# EAGLE design nav (EAGLE 9.0.0)

## Sheet 1 of 4: Atmega
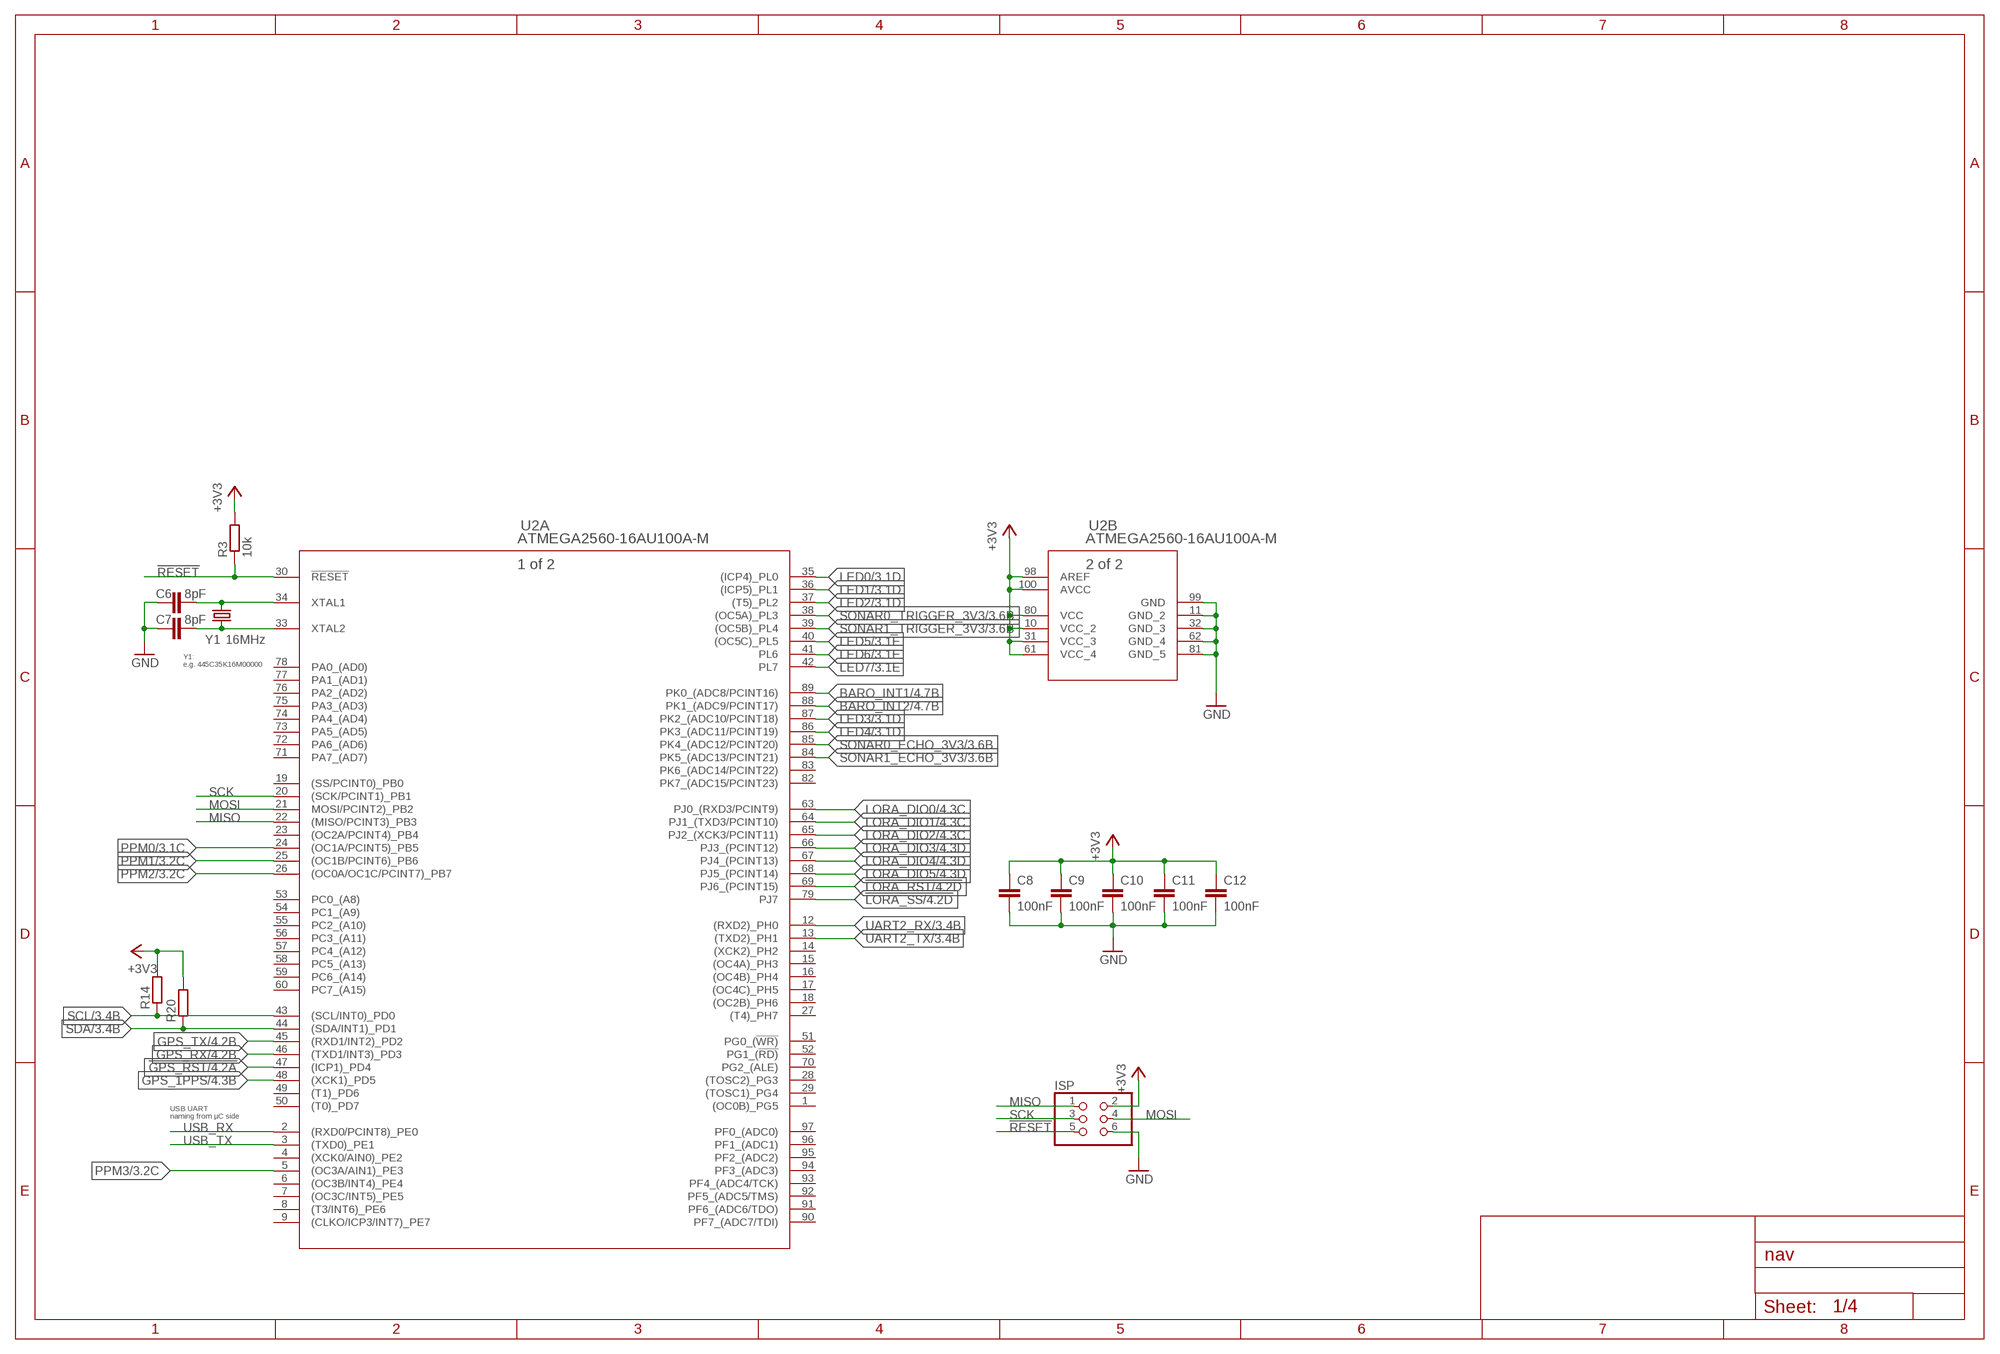
[diagram p0: schematic, sheet 1]

### Parts
C6  8pF  C-EUC0603  [C0603]
C7  8pF  C-EUC0603  [C0603]
C8  100nF  C-EUC0603  [C0603]
C9  100nF  C-EUC0603  [C0603]
C10  100nF  C-EUC0603  [C0603]
C11  100nF  C-EUC0603  [C0603]
C12  100nF  C-EUC0603  [C0603]
ISP  PINHD-2X3  [2X03]
R3  10k  R-EU_R0603  [R0603]
R14  R-EU_R0603  [R0603]
R20  R-EU_R0603  [R0603]
U2  ATMEGA2560-16AU100A-M  [100A-M]
Y1  16MHz  CRYSTALSMD-5X3.2-2PAD  [CRYSTAL-SMD-5X3.2-2PAD]

### Nets
!GPS_RST: U2.47(A:(ICP1)_PD4) ; also sheet 4
!LORA_RST: U2.69(A:PJ6_(PCINT15)) ; also sheet 4
!LORA_SS: U2.79(A:PJ7) ; also sheet 4
!RESET: ISP.5 R3.1 U2.30(A:!RESET) ; also sheet 3
+3V3: C8.1 C9.1 C10.1 C11.1 C12.1 ISP.2 R3.2 R14.2 R20.2 U2.10(B:VCC_2) U2.31(B:VCC_3) U2.61(B:VCC_4) U2.80(B:VCC) U2.98(B:AREF) U2.100(B:AVCC) ; also sheet 2,3,4
BARO_INT1: U2.89(A:PK0_(ADC8/PCINT16)) ; also sheet 4
BARO_INT2: U2.88(A:PK1_(ADC9/PCINT17)) ; also sheet 4
GND: C6.1 C7.1 C8.2 C9.2 C10.2 C11.2 C12.2 ISP.6 U2.11(B:GND_2) U2.32(B:GND_3) U2.62(B:GND_4) U2.81(B:GND_5) U2.99(B:GND) ; also sheet 2,3,4
GPS_1PPS: U2.48(A:(XCK1)_PD5) ; also sheet 4
GPS_RX: U2.46(A:(TXD1/INT3)_PD3) ; also sheet 4
GPS_TX: U2.45(A:(RXD1/INT2)_PD2) ; also sheet 4
LED0: U2.35(A:(ICP4)_PL0) ; also sheet 3
LED1: U2.36(A:(ICP5)_PL1) ; also sheet 3
LED2: U2.37(A:(T5)_PL2) ; also sheet 3
LED3: U2.87(A:PK2_(ADC10/PCINT18)) ; also sheet 3
LED4: U2.86(A:PK3_(ADC11/PCINT19)) ; also sheet 3
LED5: U2.40(A:(OC5C)_PL5) ; also sheet 3
LED6: U2.41(A:PL6) ; also sheet 3
LED7: U2.42(A:PL7) ; also sheet 3
LORA_DIO0: U2.63(A:PJ0_(RXD3/PCINT9)) ; also sheet 4
LORA_DIO1: U2.64(A:PJ1_(TXD3/PCINT10)) ; also sheet 4
LORA_DIO2: U2.65(A:PJ2_(XCK3/PCINT11)) ; also sheet 4
LORA_DIO3: U2.66(A:PJ3_(PCINT12)) ; also sheet 4
LORA_DIO4: U2.67(A:PJ4_(PCINT13)) ; also sheet 4
LORA_DIO5: U2.68(A:PJ5_(PCINT14)) ; also sheet 4
MISO: ISP.1 U2.22(A:(MISO/PCINT3)_PB3) ; also sheet 4
MOSI: ISP.4 U2.21(A:MOSI/PCINT2)_PB2) ; also sheet 4
N$2: C6.2 U2.34(A:XTAL1) Y1.P$2
N$3: C7.2 U2.33(A:XTAL2) Y1.P$1
PPM0: U2.24(A:(OC1A/PCINT5)_PB5) ; also sheet 3
PPM1: U2.25(A:(OC1B/PCINT6)_PB6) ; also sheet 3
PPM2: U2.26(A:(OC0A/OC1C/PCINT7)_PB7) ; also sheet 3
PPM3: U2.5(A:(OC3A/AIN1)_PE3) ; also sheet 3
SCK: ISP.3 U2.20(A:(SCK/PCINT1)_PB1) ; also sheet 4
SCL: R14.1 U2.43(A:(SCL/INT0)_PD0) ; also sheet 3,4
SDA: R20.1 U2.44(A:(SDA/INT1)_PD1) ; also sheet 3,4
SONAR0_ECHO_3V3: U2.85(A:PK4_(ADC12/PCINT20)) ; also sheet 3
SONAR0_TRIGGER_3V3: U2.38(A:(OC5A)_PL3) ; also sheet 3
SONAR1_ECHO_3V3: U2.84(A:PK5_(ADC13/PCINT21)) ; also sheet 3
SONAR1_TRIGGER_3V3: U2.39(A:(OC5B)_PL4) ; also sheet 3
UART2_RX: U2.12(A:(RXD2)_PH0) ; also sheet 3
UART2_TX: U2.13(A:(TXD2)_PH1) ; also sheet 3
USB_RX: U2.2(A:(RXD0/PCINT8)_PE0) ; also sheet 2
USB_TX: U2.3(A:(TXD0)_PE1) ; also sheet 2
Unconnected: U2.1(A:(OC0B)_PG5) U2.4(A:(XCK0/AIN0)_PE2) U2.6(A:(OC3B/INT4)_PE4) U2.7(A:(OC3C/INT5)_PE5) U2.8(A:(T3/INT6)_PE6) U2.9(A:(CLKO/ICP3/INT7)_PE7) U2.14(A:(XCK2)_PH2) U2.15(A:(OC4A)_PH3) U2.16(A:(OC4B)_PH4) U2.17(A:(OC4C)_PH5) U2.18(A:(OC2B)_PH6) U2.19(A:(SS/PCINT0)_PB0) U2.23(A:(OC2A/PCINT4)_PB4) U2.27(A:(T4)_PH7) U2.28(A:(TOSC2)_PG3) U2.29(A:(TOSC1)_PG4) U2.49(A:(T1)_PD6) U2.50(A:(T0)_PD7) U2.51(A:PG0_(!WR)) U2.52(A:PG1_(!RD)) U2.53(A:PC0_(A8)) U2.54(A:PC1_(A9)) U2.55(A:PC2_(A10)) U2.56(A:PC3_(A11)) U2.57(A:PC4_(A12)) U2.58(A:PC5_(A13)) U2.59(A:PC6_(A14)) U2.60(A:PC7_(A15)) U2.70(A:PG2_(ALE)) U2.71(A:PA7_(AD7)) U2.72(A:PA6_(AD6)) U2.73(A:PA5_(AD5)) U2.74(A:PA4_(AD4)) U2.75(A:PA3_(AD3)) U2.76(A:PA2_(AD2)) U2.77(A:PA1_(AD1)) U2.78(A:PA0_(AD0)) U2.82(A:PK7_(ADC15/PCINT23)) U2.83(A:PK6_(ADC14/PCINT22)) U2.90(A:PF7_(ADC7/TDI)) U2.91(A:PF6_(ADC6/TDO)) U2.92(A:PF5_(ADC5/TMS)) U2.93(A:PF4_(ADC4/TCK)) U2.94(A:PF3_(ADC3)) U2.95(A:PF2_(ADC2)) U2.96(A:PF1_(ADC1)) U2.97(A:PF0_(ADC0))

### Notes on the sheet
- Y1:
  e.g. 445C35K16M00000
- USB UART
  naming from µC side

## Sheet 2 of 4: USB-UART
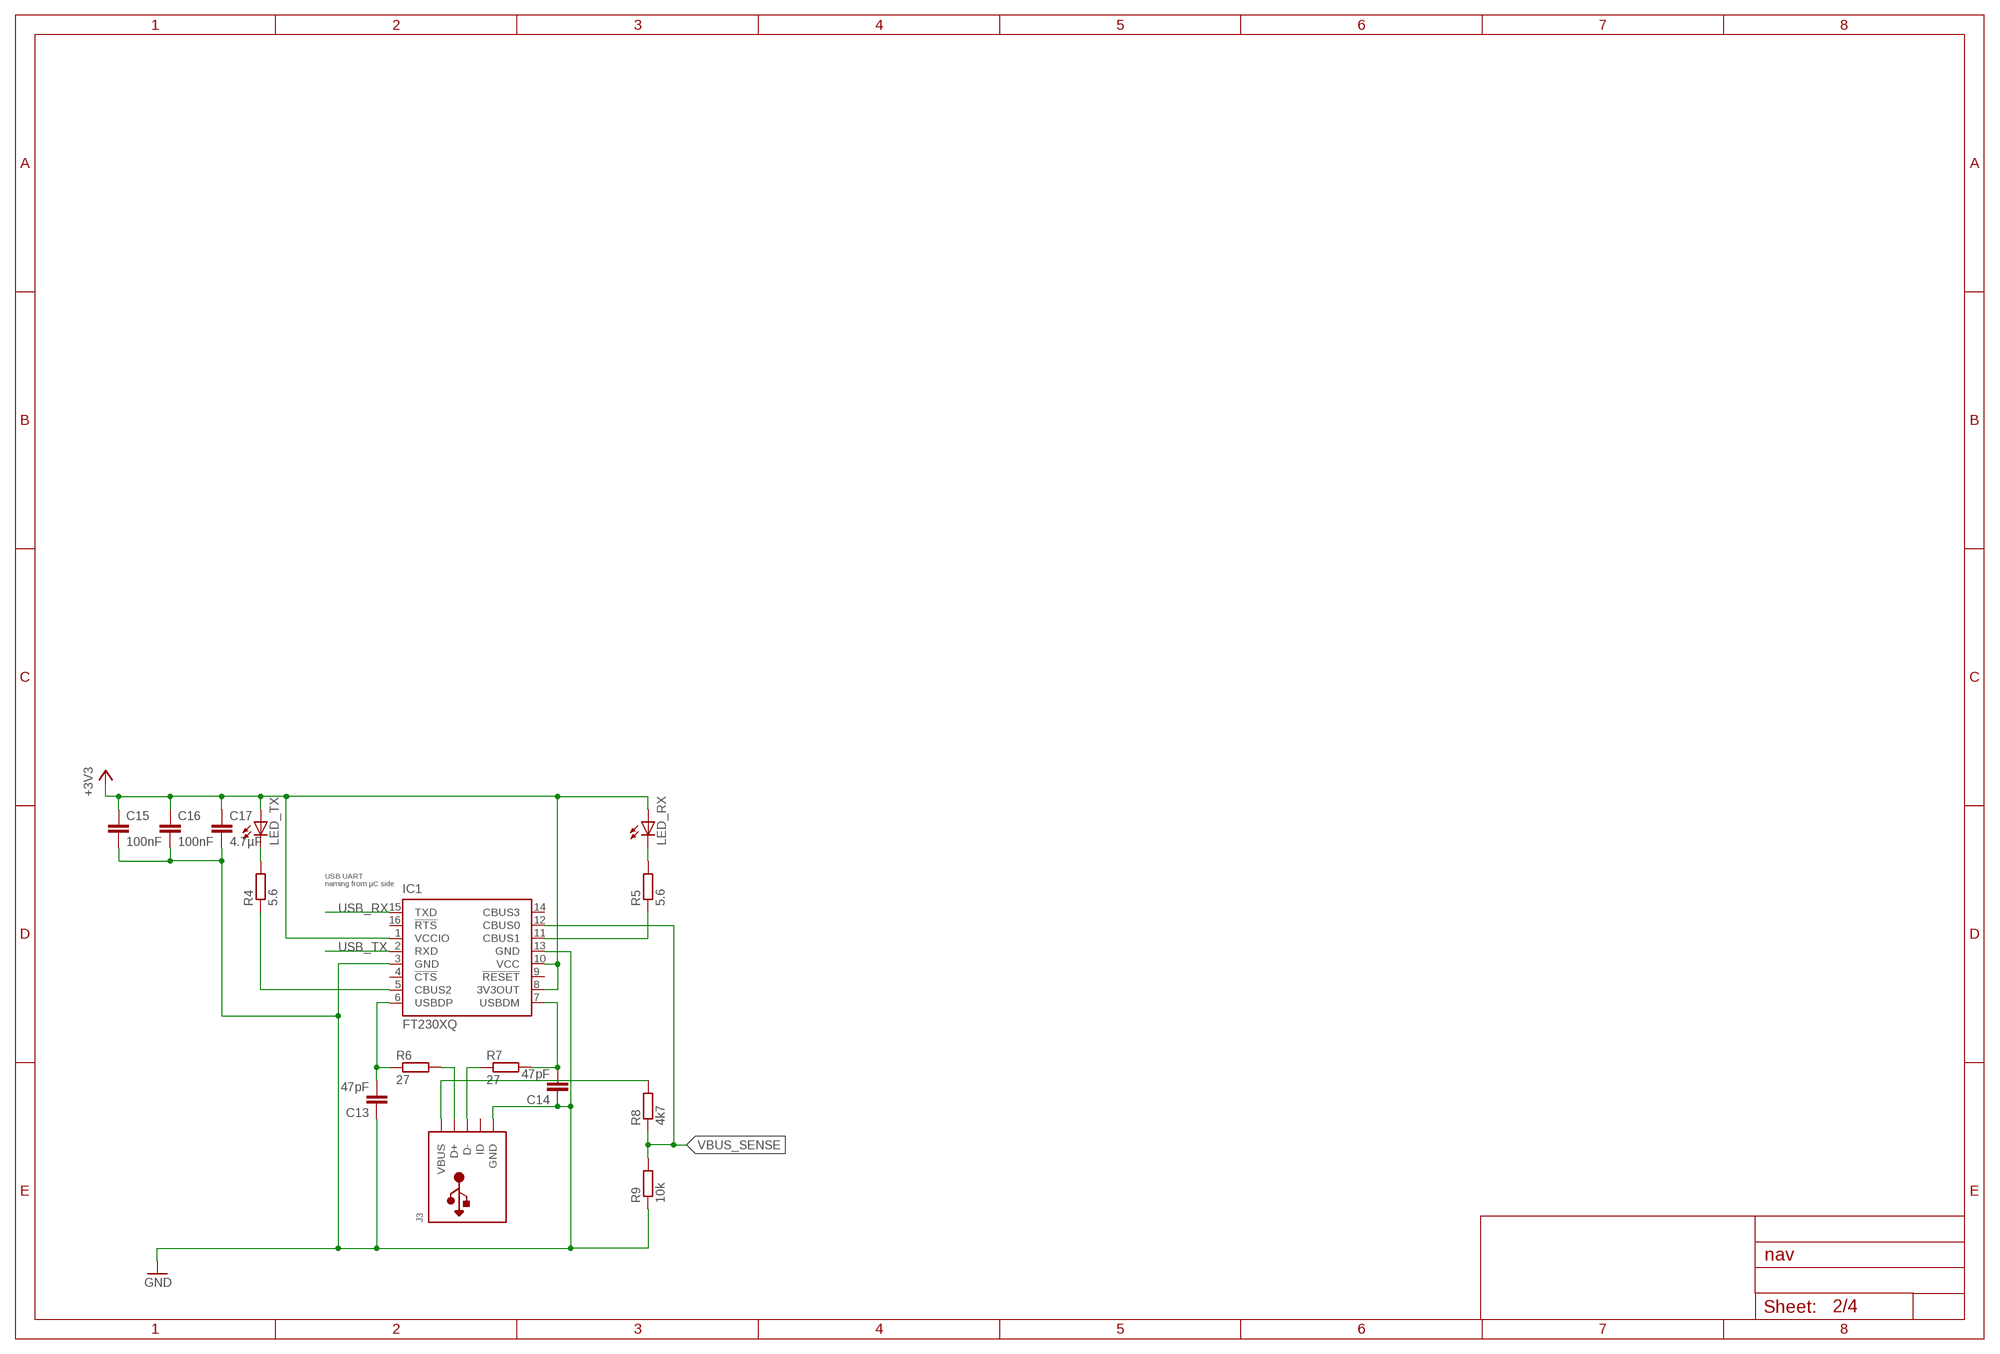
[diagram p1: schematic, sheet 2]

### Parts
C13  47pF  C-EUC0603  [C0603]
C14  47pF  C-EUC0603  [C0603]
C15  100nF  C-EUC0603  [C0603]
C16  100nF  C-EUC0603  [C0603]
C17  4.7µF  C-EUC0603  [C0603]
IC1  FT230XQ  [QFN16]
J3  USBMINIB  [USB-MINIB]
LED_RX  LEDCHIP-LED0603  [CHIP-LED0603]
LED_TX  LEDCHIP-LED0603  [CHIP-LED0603]
R4  5.6  R-EU_R0603  [R0603]
R5  5.6  R-EU_R0603  [R0603]
R6  27  R-EU_R0603  [R0603]
R7  27  R-EU_R0603  [R0603]
R8  4k7  R-EU_R0603  [R0603]
R9  10k  R-EU_R0603  [R0603]

### Nets
+3V3: C15.1 C16.1 C17.1 IC1.1(VCCIO) IC1.8(3V3OUT) IC1.10(VCC) LED_RX.A LED_TX.A ; also sheet 1,3,4
GND: C13.1 C14.1 C15.2 C16.2 C17.2 IC1.3(GND) IC1.13(GND) J3.GND R9.1 ; also sheet 1,3,4
N$4: C13.2 IC1.6(USBDP) R6.1
N$5: C14.2 IC1.7(USBDM) R7.2
N$6: IC1.5(CBUS2) R4.1
N$7: IC1.11(CBUS1) R5.1
N$8: LED_TX.C R4.2
N$9: LED_RX.C R5.2
N$10: J3.D+ R6.2
N$11: J3.D- R7.1
N$16: J3.VBUS R8.2
USB_RX: IC1.15(TXD) ; also sheet 1
USB_TX: IC1.2(RXD) ; also sheet 1
VBUS_SENSE: IC1.12(CBUS0) R8.1 R9.2
Unconnected: IC1.4(!CTS) IC1.9(!RESET) IC1.14(CBUS3) IC1.16(!RTS) J3.ID

### Notes on the sheet
- USB UART
  naming from µC side

## Sheet 3 of 4: IO
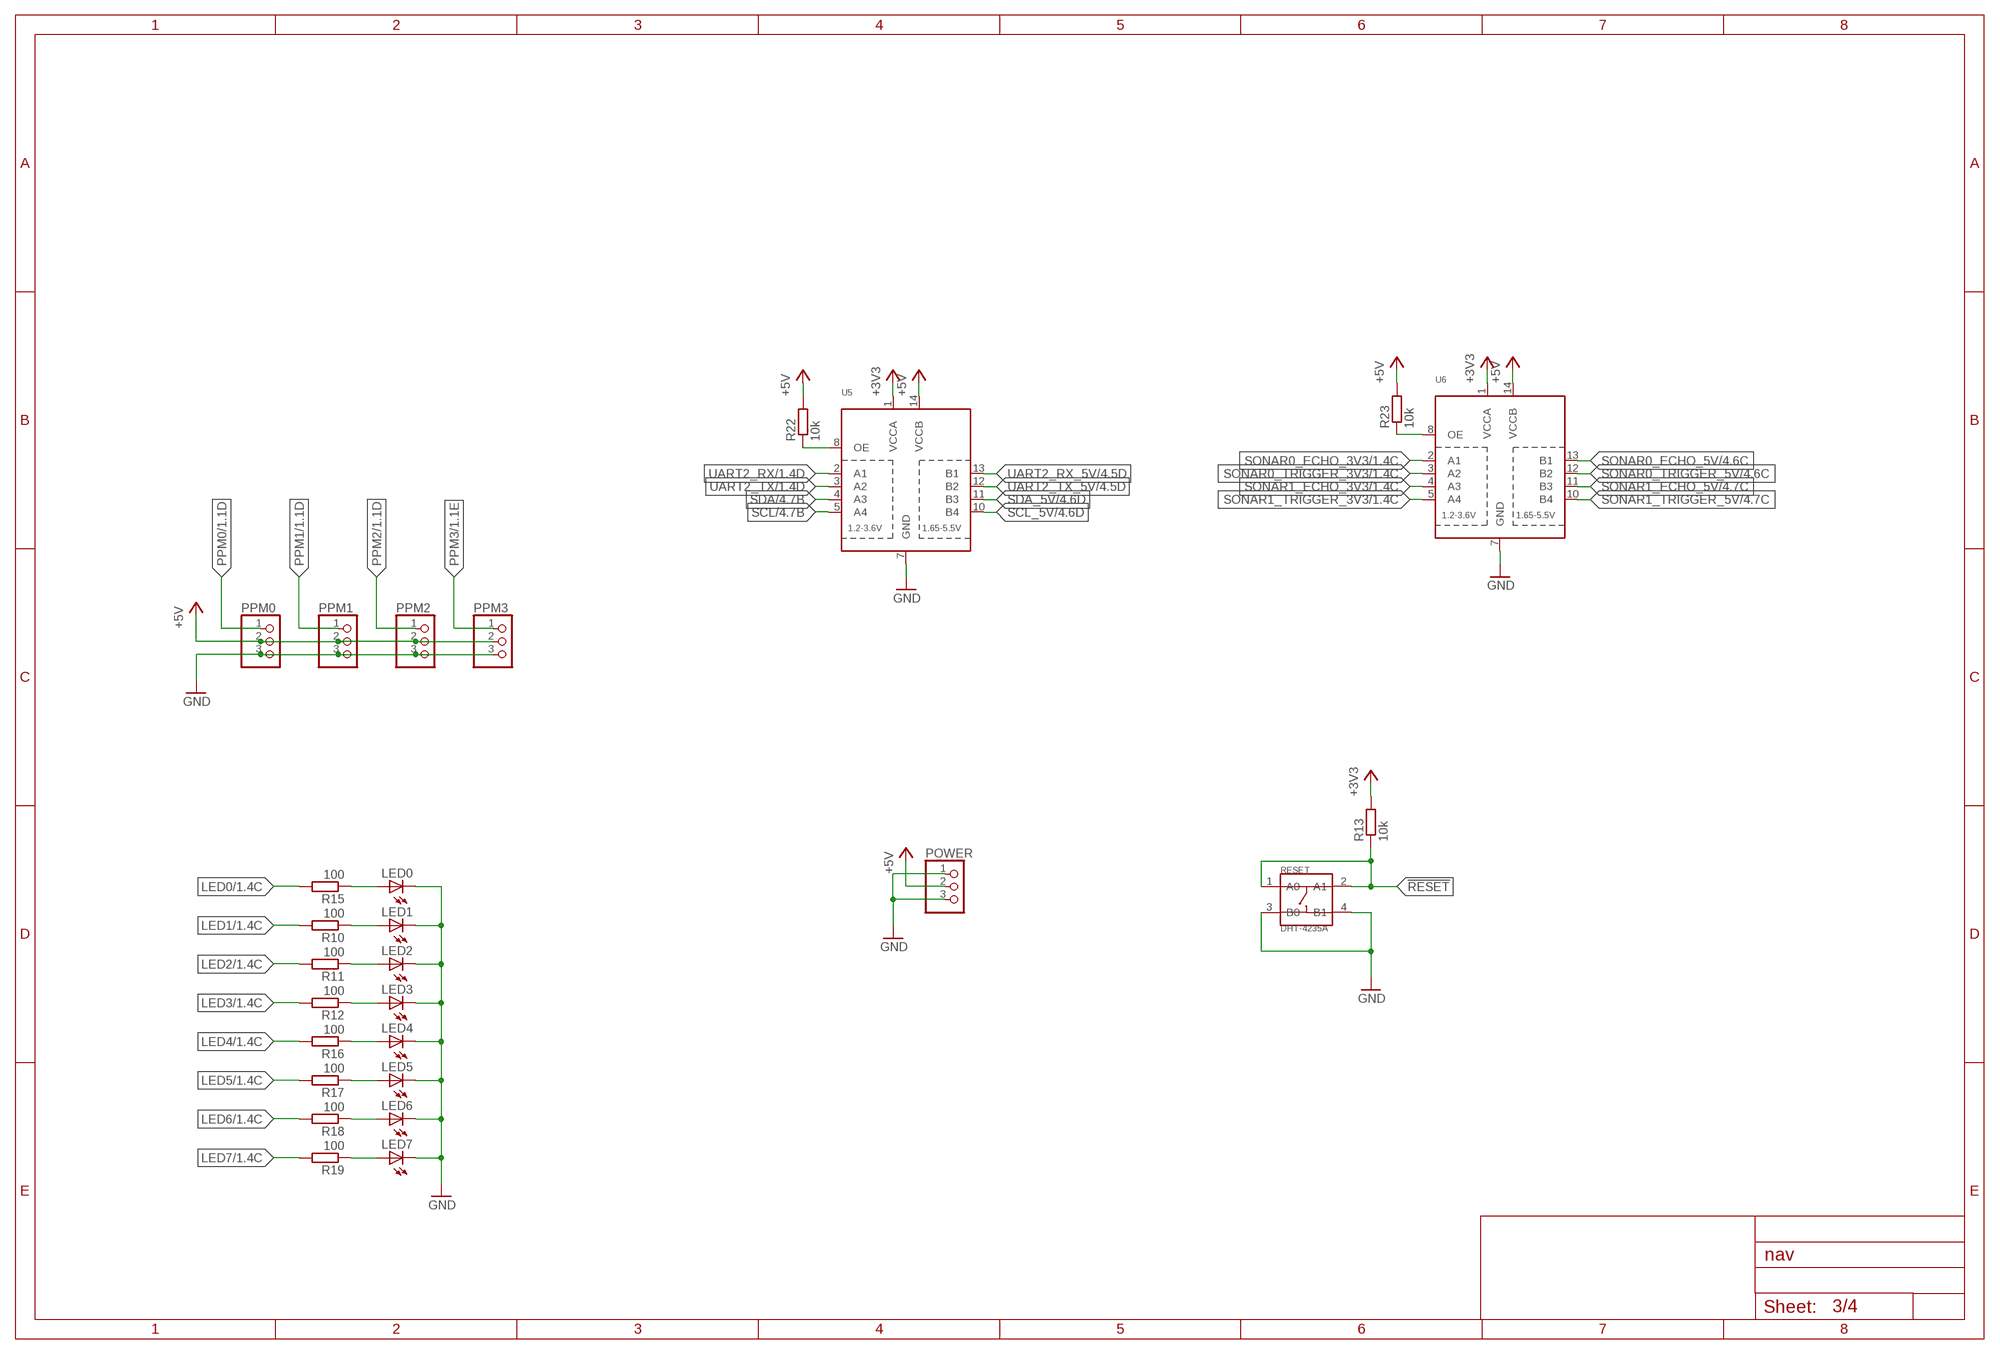
[diagram p2: schematic, sheet 3]

### Parts
LED0  LEDCHIP-LED0603  [CHIP-LED0603]
LED1  LEDCHIP-LED0603  [CHIP-LED0603]
LED2  LEDCHIP-LED0603  [CHIP-LED0603]
LED3  LEDCHIP-LED0603  [CHIP-LED0603]
LED4  LEDCHIP-LED0603  [CHIP-LED0603]
LED5  LEDCHIP-LED0603  [CHIP-LED0603]
LED6  LEDCHIP-LED0603  [CHIP-LED0603]
LED7  LEDCHIP-LED0603  [CHIP-LED0603]
POWER  PINHD-1X3  [1X03]
PPM0  PINHD-1X3  [1X03]
PPM1  PINHD-1X3  [1X03]
PPM2  PINHD-1X3  [1X03]
PPM3  PINHD-1X3  [1X03]
R10  100  R-EU_R0603  [R0603]
R11  100  R-EU_R0603  [R0603]
R12  100  R-EU_R0603  [R0603]
R13  10k  R-EU_R0603  [R0603]
R15  100  R-EU_R0603  [R0603]
R16  100  R-EU_R0603  [R0603]
R17  100  R-EU_R0603  [R0603]
R18  100  R-EU_R0603  [R0603]
R19  100  R-EU_R0603  [R0603]
R22  10k  R-EU_R0603  [R0603]
R23  10k  R-EU_R0603  [R0603]
RESET  DHT-4235A  SMD-BUTTON-TOP-DHT-4235A(4P-4.2X3.2MM)  [SW4-SMD-4.2X3.2X2.5MM]
U5  TXB0104PWR  [TSSOP14]
U6  TXB0104PWR  [TSSOP14]

### Nets
!RESET: R13.1 RESET.1(A0) RESET.2(A1) ; also sheet 1
+3V3: R13.2 U5.1(VCCA) U6.1(VCCA) ; also sheet 1,2,4
+5V: POWER.2 PPM0.2 PPM1.2 PPM2.2 PPM3.2 R22.2 R23.2 U5.14(VCCB) U6.14(VCCB) ; also sheet 4
GND: LED0.C LED1.C LED2.C LED3.C LED4.C LED5.C LED6.C LED7.C POWER.1 POWER.3 PPM0.3 PPM1.3 PPM2.3 PPM3.3 RESET.3(B0) RESET.4(B1) U5.7(GND) U6.7(GND) ; also sheet 1,2,4
LED0: R15.2 ; also sheet 1
LED1: R10.2 ; also sheet 1
LED2: R11.2 ; also sheet 1
LED3: R12.2 ; also sheet 1
LED4: R16.2 ; also sheet 1
LED5: R17.2 ; also sheet 1
LED6: R18.2 ; also sheet 1
LED7: R19.2 ; also sheet 1
N$15: LED1.A R10.1
N$18: LED2.A R11.1
N$20: LED3.A R12.1
N$22: LED4.A R16.1
N$24: LED5.A R17.1
N$27: LED6.A R18.1
N$29: LED7.A R19.1
N$31: LED0.A R15.1
N$36: R23.1 U6.8(OE)
N$37: R22.1 U5.8(OE)
PPM0: PPM0.1 ; also sheet 1
PPM1: PPM1.1 ; also sheet 1
PPM2: PPM2.1 ; also sheet 1
PPM3: PPM3.1 ; also sheet 1
SCL: U5.5(A4) ; also sheet 1,4
SCL_5V: U5.10(B4) ; also sheet 4
SDA: U5.4(A3) ; also sheet 1,4
SDA_5V: U5.11(B3) ; also sheet 4
SONAR0_ECHO_3V3: U6.2(A1) ; also sheet 1
SONAR0_ECHO_5V: U6.13(B1) ; also sheet 4
SONAR0_TRIGGER_3V3: U6.3(A2) ; also sheet 1
SONAR0_TRIGGER_5V: U6.12(B2) ; also sheet 4
SONAR1_ECHO_3V3: U6.4(A3) ; also sheet 1
SONAR1_ECHO_5V: U6.11(B3) ; also sheet 4
SONAR1_TRIGGER_3V3: U6.5(A4) ; also sheet 1
SONAR1_TRIGGER_5V: U6.10(B4) ; also sheet 4
UART2_RX: U5.2(A1) ; also sheet 1
UART2_RX_5V: U5.13(B1) ; also sheet 4
UART2_TX: U5.3(A2) ; also sheet 1
UART2_TX_5V: U5.12(B2) ; also sheet 4

## Sheet 4 of 4: Sensors
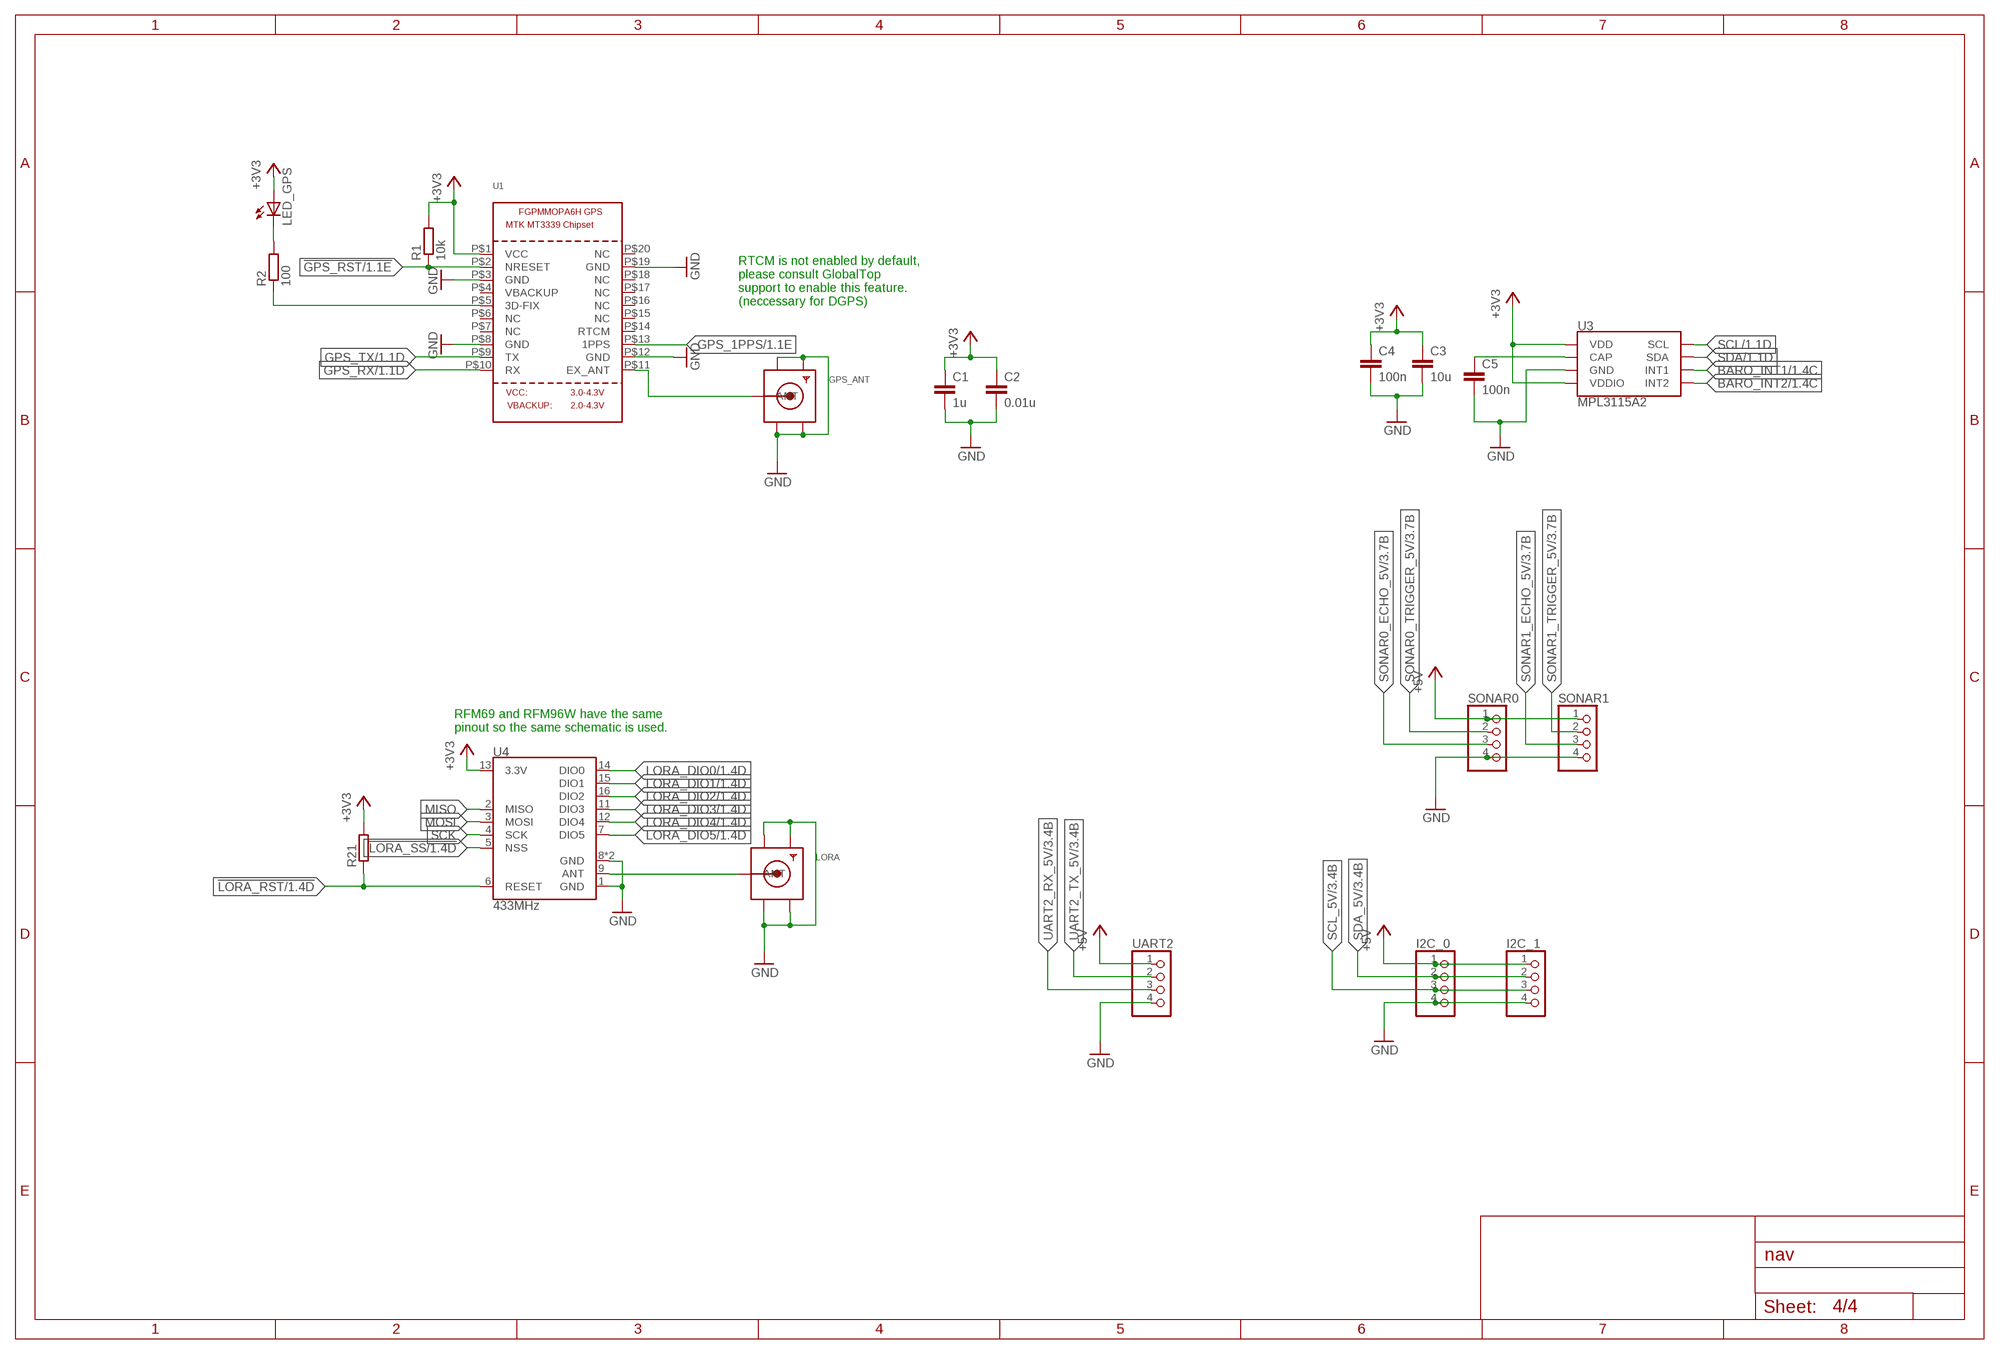
[diagram p3: schematic, sheet 4]

### Parts
C1  1u  C-EUC0603  [C0603]
C2  0.01u  C-EUC0603  [C0603]
C3  10u  C-EUC0603  [C0603]
C4  100n  C-EUC0603  [C0603]
C5  100n  C-EUC0603  [C0603]
GPS_ANT  SMACONNECTOR_EDGE  [SMA_EDGELAUNCH]
I2C_0  PINHD-1X4  [1X04]
I2C_1  PINHD-1X4  [1X04]
LED_GPS  LEDCHIP-LED0603  [CHIP-LED0603]
LORA  SMACONNECTOR_EDGE  [SMA_EDGELAUNCH]
R1  10k  R-EU_R0603  [R0603]
R2  100  R-EU_R0603  [R0603]
R21  R-EU_R0603  [R0603]
SONAR0  PINHD-1X4  [1X04]
SONAR1  PINHD-1X4  [1X04]
U1  GPS_FGPMMOPA6H  [FGPMMOPA6H]
U3  MPL3115A2  [LGA-8-5X3]
U4  433MHz  RFM69HCW-433  [RFM69HCW-XXXS2]
UART2  PINHD-1X4  [1X04]

### Nets
!GPS_RST: R1.1 U1.P$2(NRESET) ; also sheet 1
!LORA_RST: R21.1 U4.6(RESET) ; also sheet 1
!LORA_SS: U4.5(NSS) ; also sheet 1
+3V3: C1.1 C2.1 C3.1 C4.1 LED_GPS.A R1.2 R21.2 U1.P$1(VCC) U3.1(VDD) U3.4(VDDIO) U4.13(3.3V) ; also sheet 1,2,3
+5V: I2C_0.1 I2C_1.1 SONAR0.1 SONAR1.1 UART2.1 ; also sheet 3
BARO_INT1: U3.6(INT1) ; also sheet 1
BARO_INT2: U3.5(INT2) ; also sheet 1
GND: C1.2 C2.2 C3.2 C4.2 C5.2 GPS_ANT.GND@1(GND4) GPS_ANT.GND@2(GND3) GPS_ANT.GND@3(GND2) GPS_ANT.GND@4(GND1) I2C_0.4 I2C_1.4 LORA.GND@1(GND4) LORA.GND@2(GND3) LORA.GND@3(GND2) LORA.GND@4(GND1) SONAR0.4 SONAR1.4 U1.P$3(GND) U1.P$8(GND) U1.P$12(GND) U1.P$19(GND) U3.3(GND) U4.1(GND) U4.8(GND) U4.10(GND) UART2.4 ; also sheet 1,2,3
GPS_1PPS: U1.P$13(1PPS) ; also sheet 1
GPS_RX: U1.P$10(RX) ; also sheet 1
GPS_TX: U1.P$9(TX) ; also sheet 1
LORA_DIO0: U4.14(DIO0) ; also sheet 1
LORA_DIO1: U4.15(DIO1) ; also sheet 1
LORA_DIO2: U4.16(DIO2) ; also sheet 1
LORA_DIO3: U4.11(DIO3) ; also sheet 1
LORA_DIO4: U4.12(DIO4) ; also sheet 1
LORA_DIO5: U4.7(DIO5) ; also sheet 1
MISO: U4.2(MISO) ; also sheet 1
MOSI: U4.3(MOSI) ; also sheet 1
N$1: GPS_ANT.P(ANT) U1.P$11(EX_ANT)
N$12: R2.1 U1.P$5(3D-FIX)
N$13: LED_GPS.C R2.2
N$17: C5.1 U3.2(CAP)
N$30: LORA.P(ANT) U4.9(ANT)
SCK: U4.4(SCK) ; also sheet 1
SCL: U3.8(SCL) ; also sheet 1,3
SCL_5V: I2C_0.3 I2C_1.3 ; also sheet 3
SDA: U3.7(SDA) ; also sheet 1,3
SDA_5V: I2C_0.2 I2C_1.2 ; also sheet 3
SONAR0_ECHO_5V: SONAR0.3 ; also sheet 3
SONAR0_TRIGGER_5V: SONAR0.2 ; also sheet 3
SONAR1_ECHO_5V: SONAR1.3 ; also sheet 3
SONAR1_TRIGGER_5V: SONAR1.2 ; also sheet 3
UART2_RX_5V: UART2.3 ; also sheet 3
UART2_TX_5V: UART2.2 ; also sheet 3
Unconnected: U1.P$4(VBACKUP) U1.P$6(NC) U1.P$7(NC) U1.P$14(RTCM) U1.P$15(NC) U1.P$16(NC) U1.P$17(NC) U1.P$18(NC) U1.P$20(NC)

### Notes on the sheet
- RTCM is not enabled by default,
  please consult GlobalTop
  support to enable this feature.
  (neccessary for DGPS)
- RFM69 and RFM96W have the same
  pinout so the same schematic is used.

## Library data of the parts
C1-C5 = resistor:C-EU: CAPACITOR, European symbol
C6-C17 = rcl:C-EU: CAPACITOR, European symbol; SPICEPREFIX: C
GPS_ANT LORA = adafruit:SMACONNECTOR: SMA Connector 90° DIP SMA Connector, 50 Ohm (4UConnector: 07259)
I2C_0 I2C_1 SONAR0 SONAR1 UART2 = pinhead:PINHD-1X4: PIN HEADER
IC1 = ftdichip:FT230X: USB to BASIC UART IC Auto generated by make-symbol-device-package-bsdl.ulp Rev. 43 Source: Data sheet <http://www.ftdichip.com/Support/Documents/DataSheets/ICs/DS_FT230X.pdf>
ISP = pinhead:PINHD-2X3: PIN HEADER
J3 = adafruit:USB: USB Connectors USBMINIB - Surface Mount Female Mini-B USB Connector 4UConnector: 06564 By microbuilder.eu Thru-hole RA Female Mini-B USB Connector 4UConnector: 18732 By ladyada.net
LED0 LED1-LED7 LED_GPS LED_RX LED_TX = led:LED: LED OSRAM: - CHIPLED LG R971, LG N971, LY N971, LG Q971, LY Q971, LO R971, LY R971 LH N974, LH R974 LS Q976, LO Q976, LY Q976 LO Q996 - Hyper CHIPLED LW Q18S LB Q993, LB Q99A, LB R99A - SideLED LS A670, LO A670, LY A670, LG A670, LP A670 LB A673, LV A673, LT A673, LW A673 LH A674 LY A675 LS A676, LA A676, LO A676, LY A676, LW A676 LS A679, LY A679, LG A679 - Hyper Micro SIDELED® LS Y876, LA Y876, LO Y876, LY Y876 LT Y87S - SmartLED LW L88C, LW L88S LB L89C, LB L89S, LG L890 LS L89K, LO L89K, LY L89K LS L896, LA L896, LO L896, LY L896 - TOPLED LS T670, LO T670, LY T670, LG T670, LP T670 LSG T670, LSP T670, LSY T670, LOP T670, LYG T670 LG T671, LOG T671, LSG T671 LB T673, LV T673, LT T673, LW T673 LH T674 LS T676, LA T676, LO T676, LY T676, LB T676, LH T676, LSB T676, LW T676 LB T67C, LV T67C, LT T67C, LS T67K, LO T67K, LY T67K, LW E67C LS E67B, LA E67B, LO E67B, LY E67B, LB E67C, LV E67C, LT E67C LW T67C LS T679, LY T679, LG T679 LS T770, LO T770, LY T770, LG T770, LP T770 LB T773, LV T773, LT T773, LW T773 LH T774 LS E675, LA E675, LY E675, LS T675 LS T776, LA T776, LO T776, LY T776, LB T776 LHGB T686 LT T68C, LB T68C - Hyper Mini TOPLED® LB M676 - Mini TOPLED Santana® LG M470 LS M47K, LO M47K, LY M47K Source: http://www.osram.convergy.de LUXEON: - LUMILED® LXK2-PW12-R00, LXK2-PW12-S00, LXK2-PW14-U00, LXK2-PW14-V00 LXK2-PM12-R00, LXK2-PM12-S00, LXK2-PM14-U00 LXK2-PE12-Q00, LXK2-PE12-R00, LXK2-PE12-S00, LXK2-PE14-T00, LXK2-PE14-U00 LXK2-PB12-K00, LXK2-PB12-L00, LXK2-PB12-M00, LXK2-PB14-N00, LXK2-PB14-P00, LXK2-PB14-Q00 LXK2-PR12-L00, LXK2-PR12-M00, LXK2-PR14-Q00, LXK2-PR14-R00 LXK2-PD12-Q00, LXK2-PD12-R00, LXK2-PD12-S00 LXK2-PH12-R00, LXK2-PH12-S00 LXK2-PL12-P00, LXK2-PL12-Q00, LXK2-PL12-R00 Source: www.luxeon.com KINGBRIGHT: KA-3528ASYC Source: www.kingbright.com
POWER PPM0 PPM1-PPM3 = pinhead:PINHD-1X3: PIN HEADER
R1 R2 R13 R14 R20-R23 = resistor:R-EU_: RESISTOR, European symbol
R3-R12 R15-R19 = rcl:R-EU_: RESISTOR, European symbol; SPICEPREFIX: R
RESET = Seeed-Switch:SMD-BUTTON-TOP-DHT-4235A(4P-4.2X3.2MM): 311020045; MPN: DHT-4235A
U1 = adafruit:GPS_FGPMMOPA6H: GPS Module - MTK MT3339 Chipset, -165dBm sensitivity, 22 channels, 10Hz, auto-select external antenna options
U2 = ATMEGA2560:ATMEGA2560-16AU; MANUFACTURER_PART_NUMBER: ATMEGA256016AU; VENDOR: Atmel
U3 = SparkFun-Sensors:MPL3115A2: NXP MPL3115A2 Digital Altimeter/Pressure Sensor The MPL3115A2 is a compact piezoresistive absolute pressure sensor with an I2C interface. MPL3115 has a wide operating range of 20kPa to 110 kPa, a range that covers all surface elevations on Earth. The fully internally compensated MEMS in conjunction with an embedded high resolution 24-bit equivalent ADC provide accurate pressure [Pascals] /altitude [meters] and temperature [degrees Celsius] data. Datasheet <http://cdn.sparkfun.com/datasheets/Sensors/Pressure/MPL3115A2.pdf> SparkFun Products SparkFun Altitude/Pressure Sensor Breakout - MPL3115A2 <https://www.sparkfun.com/products/11084> (SEN-11084) SparkFun Weather Shield <https://www.sparkfun.com/products/12081> (DEV-12081) SparkFun Photon Weather Shield <https://www.sparkfun.com/products/13630> (DEV-13630); PROD_ID: IC-10869
U4 = SparkFun-RF:RFM69H: Hope RF RFM69H ISM Transceiver Module The RFM69H is a transceiver module capable of operation over a wide frequency range, including the 315,433,868 and 915MHz license-free ISM (Industry Scientific and Medical) frequency bands. All major RF communication parameters are programmable and most of them can be dynamically set. The RFM69H offers the unique advantage of programmable narrow-band and wide- band communication modes. The RFM69H is optimized for low power consumption while offering high RF output power and channelized operation.Compliance ETSI and FCC regulations. Datasheet <http://www.hoperf.cn/upload/docs/RF/SX/RFM69H_DataSheet_v1.3.pdf> SparkFun Products RFM69HCW Wireless Transceiver - 915MHz <https://www.sparkfun.com/products/13909> (COM-13909) RFM69HCW Wireless Transceiver - 434MHz <https://www.sparkfun.com/products/13910> (COM-13910) SparkFun RFM69 Breakout (915MHz) <https://www.sparkfun.com/products/12775> (WRL-12775) SparkFun RFM69 Breakout (434MHz) <https://www.sparkfun.com/products/12823> (WRL-12823); PROD_ID: IC-12053
U5 U6 = adafruit:TXB0104PWR: 4-Bit Bi-Directional Level Shifter 1.2V-3.6V (VCCA) to 1.65V-5.5V (VCCB) bi-directional level shifter with auto direction sensing. Max data rate - VCCA 1.8V: 20Mbps (50ns), VCCA 3.3V: 100Mbps (10ns) Digikey: 296-21929-1-ND
Y1 = SparkFun-Clocks:CRYSTAL: Crystals (Generic) These are passive quartz crystals, which can be used as a clock source for a microcontroller. Crystal's are two-terminal devices. They require external "load" capacitors to generate an oscillating signal.

## Board
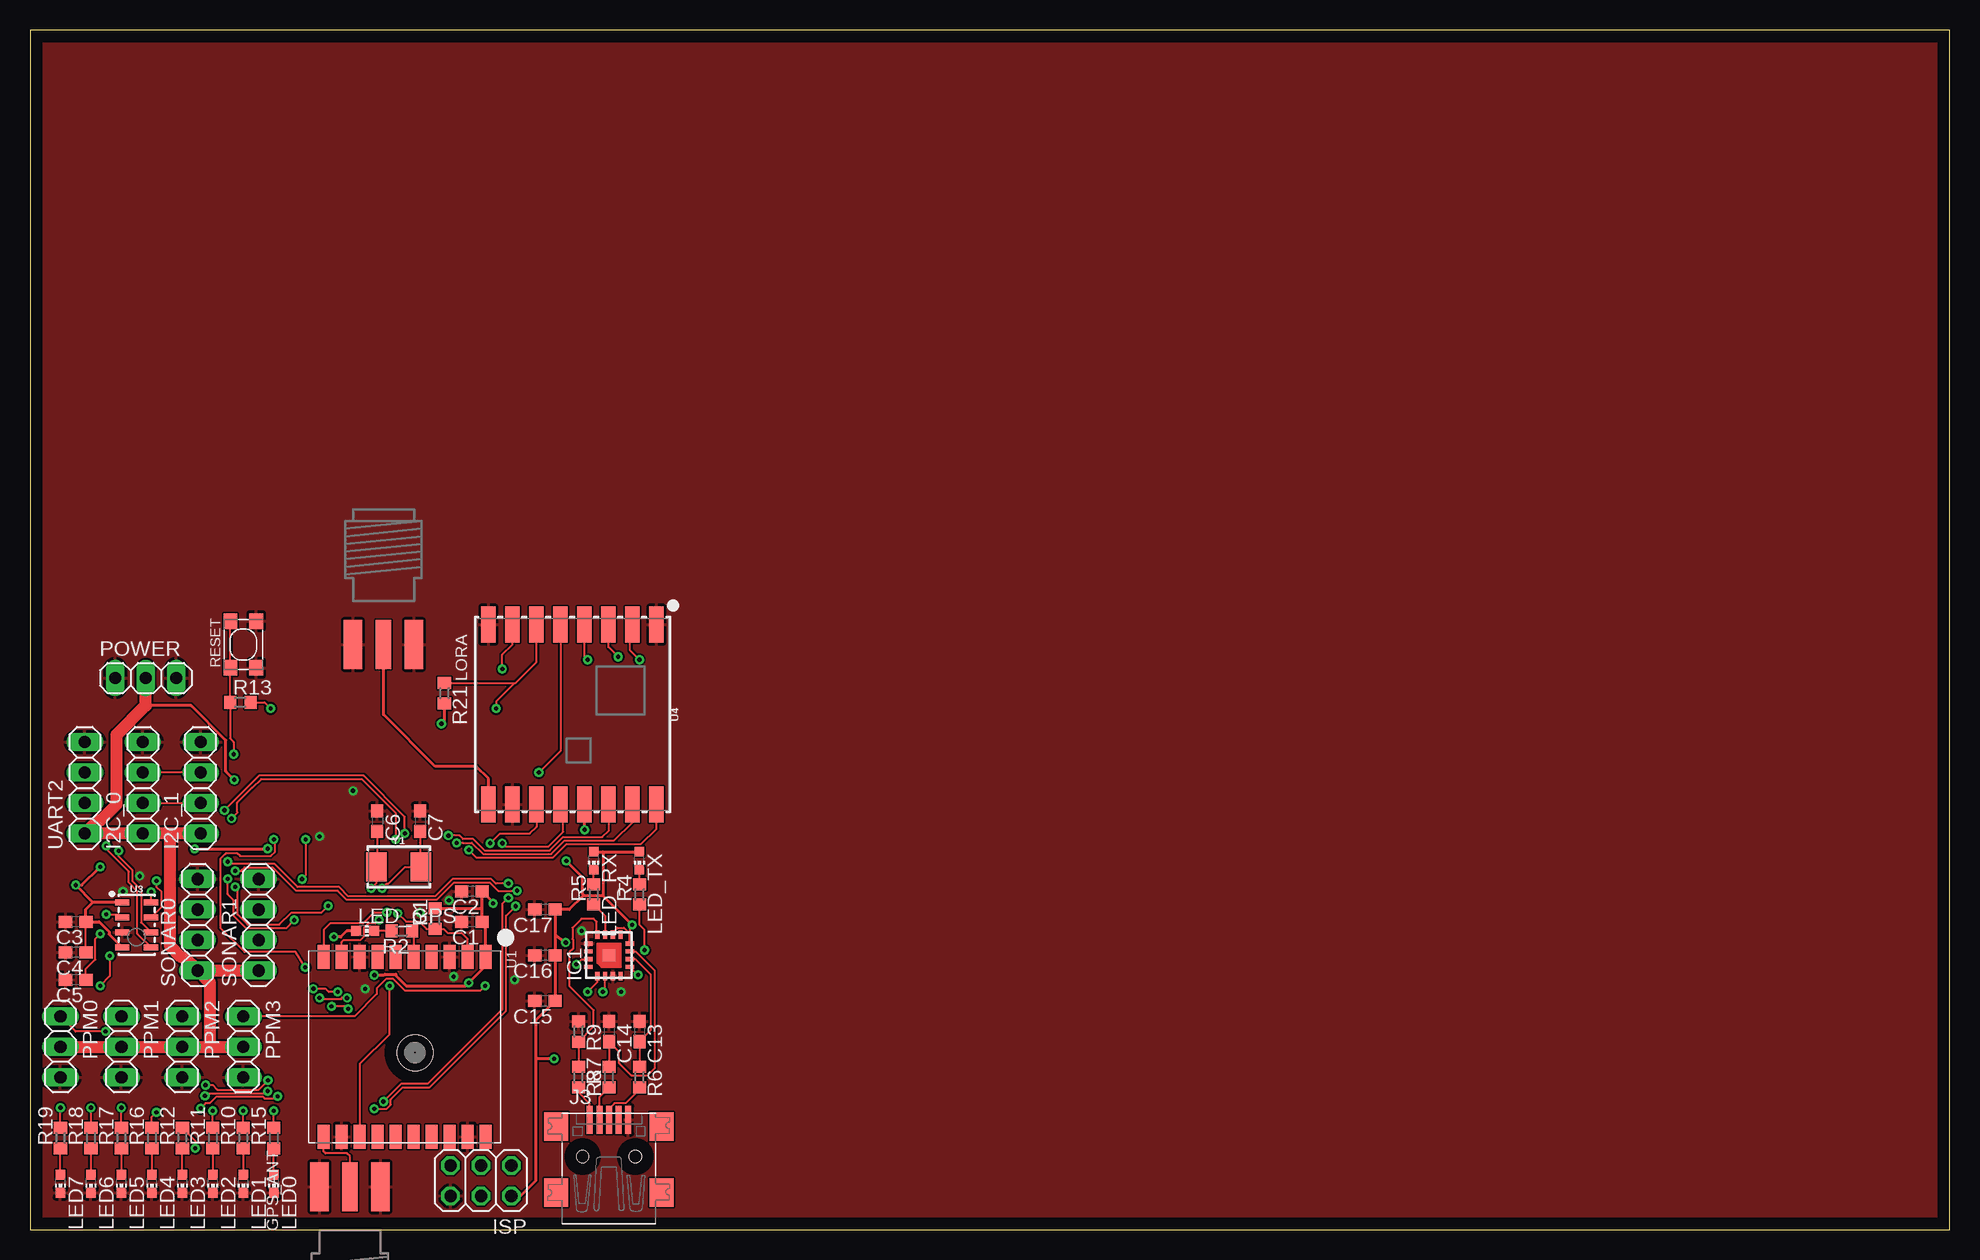
[diagram p4: board, top side]
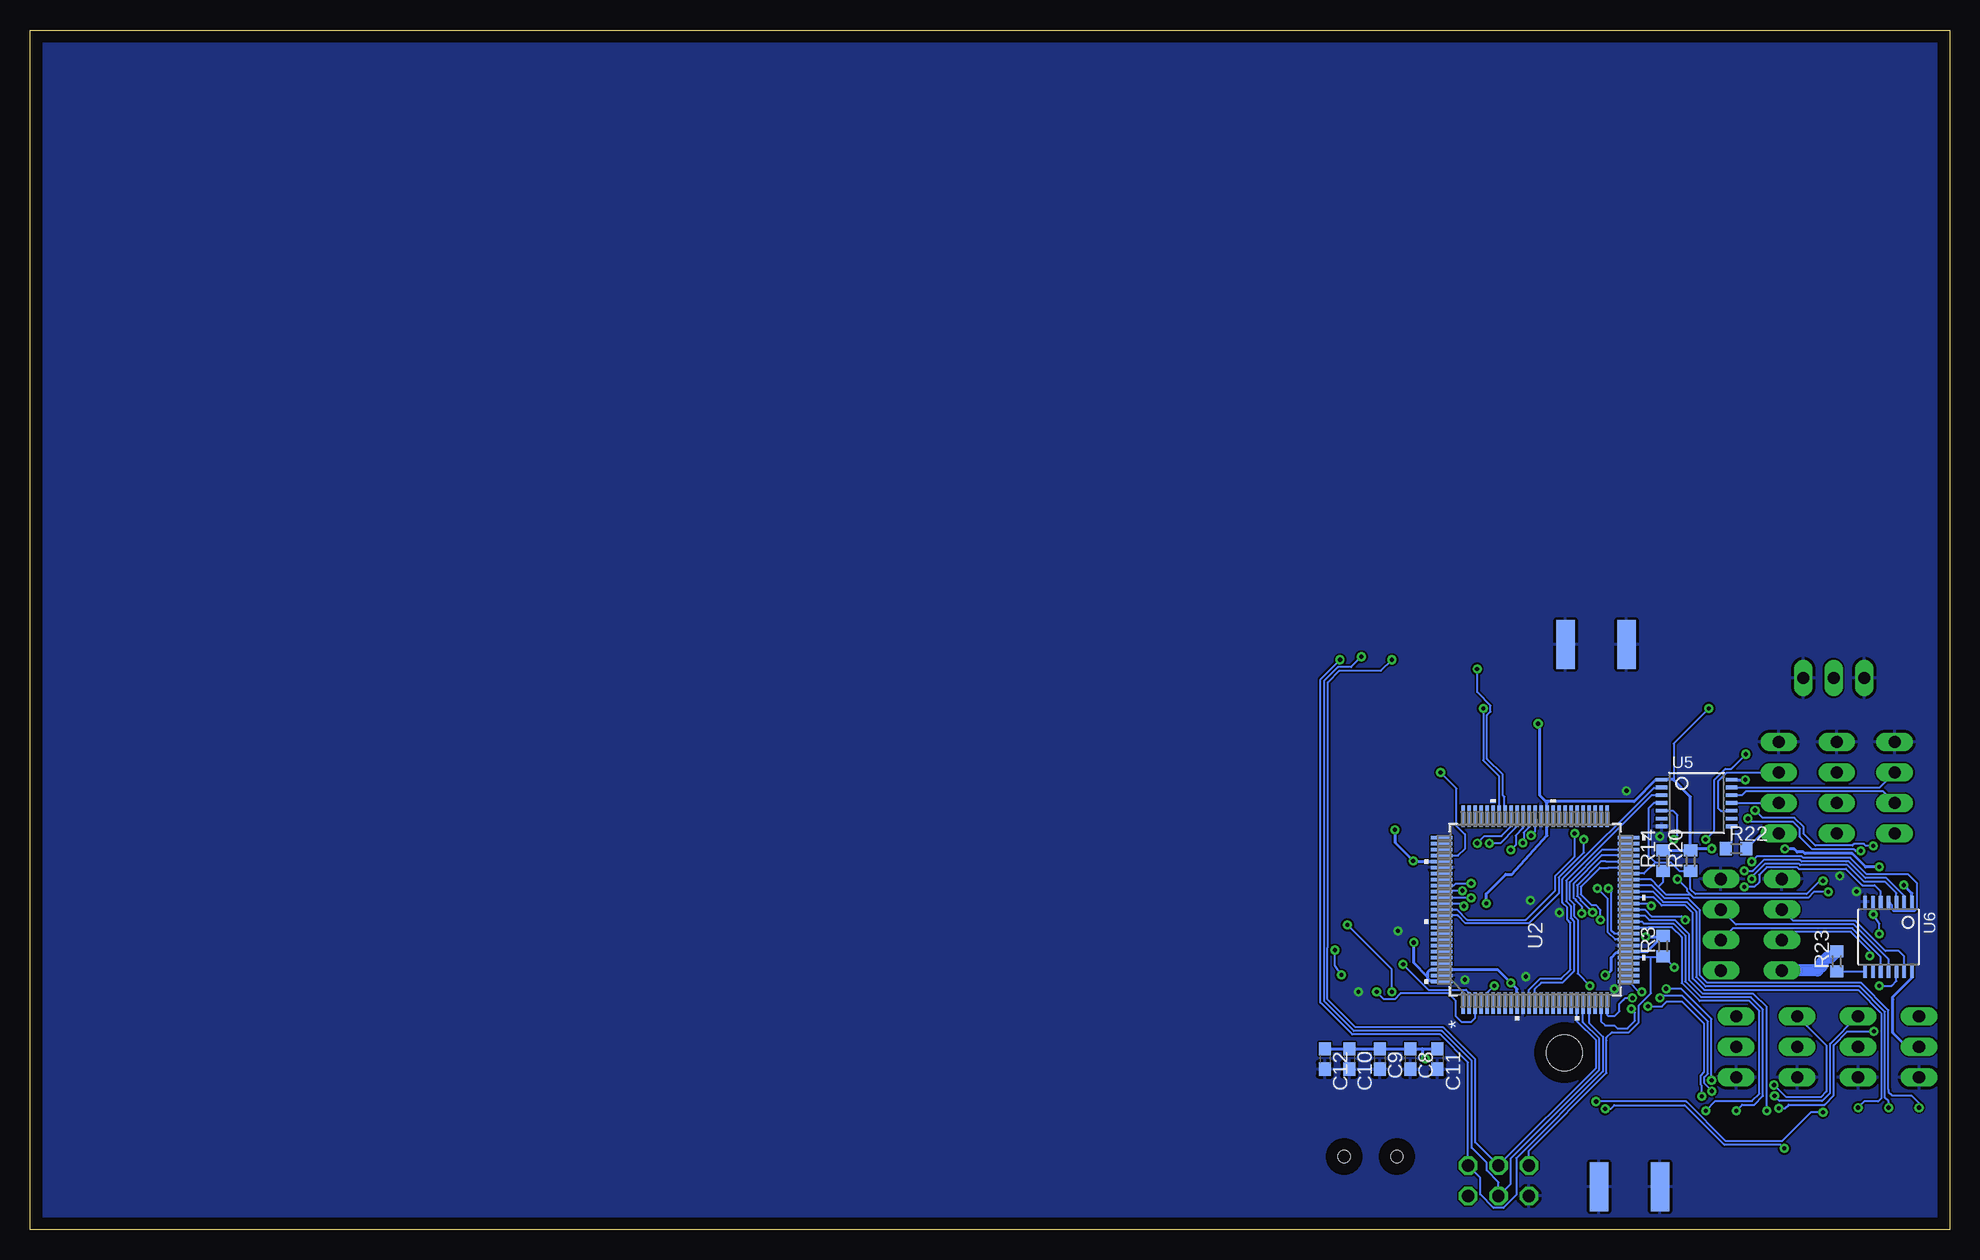
[diagram p5: board, bottom side, seen from below]

Size 160 x 100 mm. Coordinates in mm from the lower left corner, seen from the top.
Outline: 0,0 160,0 160,100 0,100 0,0
Copper layers (1*16): Top 0.035mm / dielectric 1.5mm / Bottom 0.035mm
Design rules "default": minimum track width 6mil, minimum drill 0.35mm, track to track 6mil, track to pad 6mil, pad to pad 6mil, via to via 6mil, smd to smd 6mil, copper to edge 40mil, drill to drill 6mil, minimum pad ring 10mil, minimum via ring 8mil, stop-mask expansion 4mil, vias tented up to drill 0mil, thermal gap 10mil

### Footprints (pad centres in the part's own frame; a part is rotated, then mirrored left to right if it is on the bottom)
C0603 = smd 1.1 x 1: 1 -0.85,0; 2 0.85,0
SMA_EDGELAUNCH = smd 4.064 x 1.524: GND@1 2.032,-2.54; GND@2 2.032,2.54 | smd 4.064 x 1.524 bottom: GND@3 2.032,2.54; GND@4 2.032,-2.54 | smd 4.064 x 1.27: P 2.032,0
1X04 = drill 1.016 long: 1 -3.81,0; 2 -1.27,0; 3 1.27,0; 4 3.81,0
QFN16 = smd 0.7 x 0.35: 1 -1.725,0.975; 2 -1.725,0.325; 3 -1.725,-0.325; 4 -1.725,-0.975; 9 1.725,-0.975; 10 1.725,-0.325; 11 1.725,0.325; 12 1.725,0.975 | smd 0.35 x 0.7: 5 -0.975,-1.725; 6 -0.325,-1.725; 7 0.325,-1.725; 8 0.975,-1.725; 13 0.975,1.725; 14 0.325,1.725; 15 -0.325,1.725; 16 -0.975,1.725 | smd 1 x 1: TAB 0,0
2X03 = drill 1.016 octagon: 1 -2.54,-1.27; 2 -2.54,1.27; 3 0,-1.27; 4 0,1.27; 5 2.54,-1.27; 6 2.54,1.27
USB-MINIB = smd 0.5 x 2.308: D+ 0,4.064; D- -0.8,4.064; GND 1.6,4.064; ID 0.8,4.064; VBUS -1.6,4.064 | smd 2 x 2.4: GND1 -4.4,-2; GND2 -4.4,3.5; GND3 4.4,3.5; GND4 4.4,-2 | hole 1: -2.2,1; 2.2,1
CHIP-LED0603 = smd 0.8 x 0.8: A 0,-0.75; C 0,0.75
1X03 = drill 1.016 long: 1 -2.54,0; 2 0,0; 3 2.54,0
R0603 = smd 1 x 1.1: 1 -0.85,0; 2 0.85,0
SW4-SMD-4.2X3.2X2.5MM = smd 1.3 x 1.15: 1 -1.95,1.075; 2 1.95,1.075; 3 -1.95,-1.075; 4 1.95,-1.075
FGPMMOPA6H = smd 2 x 1: P$1 -7.5,6.75; P$2 -7.5,5.25; P$3 -7.5,3.75; P$4 -7.5,2.25; P$5 -7.5,0.75; P$6 -7.5,-0.75; P$7 -7.5,-2.25; P$8 -7.5,-3.75; P$9 -7.5,-5.25; P$10 -7.5,-6.75; P$11 7.5,-6.75; P$12 7.5,-5.25; P$13 7.5,-3.75; P$14 7.5,-2.25; P$15 7.5,-0.75; P$16 7.5,0.75; P$17 7.5,2.25; P$18 7.5,3.75; P$19 7.5,5.25; P$20 7.5,6.75 | hole 3: 0.5,0.85
100A-M = smd 1.778 x 0.279: 1 -7.798,6; 2 -7.798,5.5; 3 -7.798,5; 4 -7.798,4.5; 5 -7.798,4; 6 -7.798,3.5; 7 -7.798,3; 8 -7.798,2.5; 9 -7.798,2; 10 -7.798,1.5; 11 -7.798,1; 12 -7.798,0.5; 13 -7.798,0; 14 -7.798,-0.5; 15 -7.798,-1; 16 -7.798,-1.5; 17 -7.798,-2; 18 -7.798,-2.5; 19 -7.798,-3; 20 -7.798,-3.5; 21 -7.798,-4; 22 -7.798,-4.5; 23 -7.798,-5; 24 -7.798,-5.5; 25 -7.798,-6; 51 7.798,-6; 52 7.798,-5.5; 53 7.798,-5; 54 7.798,-4.5; 55 7.798,-4; 56 7.798,-3.5; 57 7.798,-3; 58 7.798,-2.5; 59 7.798,-2; 60 7.798,-1.5; 61 7.798,-1; 62 7.798,-0.5; 63 7.798,0; 64 7.798,0.5; 65 7.798,1; 66 7.798,1.5; 67 7.798,2; 68 7.798,2.5; 69 7.798,3; 70 7.798,3.5; 71 7.798,4; 72 7.798,4.5; 73 7.798,5; 74 7.798,5.5; 75 7.798,6 | smd 0.279 x 1.778: 26 -6,-7.798; 27 -5.5,-7.798; 28 -5,-7.798; 29 -4.5,-7.798; 30 -4,-7.798; 31 -3.5,-7.798; 32 -3,-7.798; 33 -2.5,-7.798; 34 -2,-7.798; 35 -1.5,-7.798; 36 -1,-7.798; 37 -0.5,-7.798; 38 0,-7.798; 39 0.5,-7.798; 40 1,-7.798; 41 1.5,-7.798; 42 2,-7.798; 43 2.5,-7.798; 44 3,-7.798; 45 3.5,-7.798; 46 4,-7.798; 47 4.5,-7.798; 48 5,-7.798; 49 5.5,-7.798; 50 6,-7.798; 76 6,7.798; 77 5.5,7.798; 78 5,7.798; 79 4.5,7.798; 80 4,7.798; 81 3.5,7.798; 82 3,7.798; 83 2.5,7.798; 84 2,7.798; 85 1.5,7.798; 86 1,7.798; 87 0.5,7.798; 88 0,7.798; 89 -0.5,7.798; 90 -1,7.798; 91 -1.5,7.798; 92 -2,7.798; 93 -2.5,7.798; 94 -3,7.798; 95 -3.5,7.798; 96 -4,7.798; 97 -4.5,7.798; 98 -5,7.798; 99 -5.5,7.798; 100 -6,7.798
LGA-8-5X3 = smd 1.2 x 0.5: 1 -1.2,1.875; 2 -1.2,0.625; 3 -1.2,-0.625; 4 -1.2,-1.875; 5 1.2,-1.875; 6 1.2,-0.625; 7 1.2,0.625; 8 1.2,1.875
RFM69HCW-XXXS2 = smd 3 x 1.2: 1 -7.5,7; 2 -7.5,5; 3 -7.5,3; 4 -7.5,1; 5 -7.5,-1; 6 -7.5,-3; 7 -7.5,-5; 8 -7.5,-7; 9 7.5,-7; 10 7.5,-5; 11 7.5,-3; 12 7.5,-1; 13 7.5,1; 14 7.5,3; 15 7.5,5; 16 7.5,7
TSSOP14 = smd 0.305 x 0.991: 1 -1.95,-2.918; 2 -1.3,-2.918; 3 -0.65,-2.918; 4 0,-2.918; 5 0.65,-2.918; 6 1.3,-2.918; 7 1.95,-2.918; 8 1.95,2.918; 9 1.3,2.918; 10 0.65,2.918; 11 0,2.918; 12 -0.65,2.918; 13 -1.3,2.918; 14 -1.95,2.918
CRYSTAL-SMD-5X3.2-2PAD = smd 1.7 x 2.4: P$1 1.85,0; P$2 -1.85,0

### Placement (x,y rotation side)
C1  36.83,25.65 180 top
C2  36.83,28.19 180 top
C3  3.81,25.65 180 top
C4  3.81,23.11 180 top
C5  3.81,20.83 180 top
C6  28.96,34.04 270 top
C7  32.51,34.04 270 top
C8  44.96,14.22 270 bottom
C9  47.5,14.22 270 bottom
C10  50.04,14.22 270 bottom
C11  42.67,14.22 270 bottom
C12  52.07,14.22 270 bottom
C13  50.8,16.51 270 top
C14  48.26,16.51 270 top
C15  42.93,19.05 180 top
C16  42.93,22.86 180 top
C17  42.93,26.67 180 top
GPS_ANT  26.67,1.52 90 top
I2C_0  9.4,36.83 90 top
I2C_1  14.22,36.83 90 top
IC1  48.26,22.86 90 top
ISP  37.59,4.06 180 top
J3  48.26,5.08 0 top
LED0  20.32,3.81 180 top
LED1  17.78,3.81 180 top
LED2  15.24,3.81 180 top
LED3  12.7,3.81 180 top
LED4  10.16,3.81 180 top
LED5  7.62,3.81 180 top
LED6  5.08,3.81 180 top
LED7  2.54,3.81 180 top
LED_GPS  27.94,24.89 270 top
LED_RX  46.99,30.73 180 top
LED_TX  50.8,30.73 180 top
LORA  29.46,50.8 270 top
POWER  9.65,45.97 0 top
PPM0  2.54,15.24 270 top
PPM1  7.62,15.24 270 top
PPM2  12.7,15.24 270 top
PPM3  17.78,15.24 270 top
R1  33.78,25.91 90 top
R2  30.99,24.89 180 top
R3  23.88,23.62 90 bottom
R4  50.8,27.94 90 top
R5  46.99,27.94 90 top
R6  50.8,12.7 270 top
R7  48.26,12.7 90 top
R8  45.72,12.7 270 top
R9  45.72,16.51 270 top
R10  17.78,7.62 90 top
R11  15.24,7.62 90 top
R12  12.7,7.62 90 top
R13  17.53,43.94 0 top
R14  23.88,30.73 90 bottom
R15  20.32,7.62 90 top
R16  10.16,7.62 90 top
R17  7.62,7.62 90 top
R18  5.08,7.62 90 top
R19  2.54,7.62 90 top
R20  21.59,30.73 90 bottom
R21  34.54,44.7 270 top
R22  17.78,31.75 0 bottom
R23  9.4,22.35 90 bottom
RESET  17.78,48.77 90 top
SONAR0  13.97,25.4 90 top
SONAR1  19.05,25.4 90 top
U1  31.24,15.24 270 top
U2  34.54,26.67 90 bottom
U3  8.89,25.4 0 top
U4  45.21,42.93 270 top
U5  21.08,35.56 270 bottom
U6  5.08,24.38 180 bottom
UART2  4.57,36.83 90 top
Y1  30.73,30.23 0 top

### Tracks (layer width: path | path; a pad name or v marks a point on that pad's centre or on a via)
!GPS_RST  (via drill 0.35)
  Top 0.152: U1.P$2 36.49,24.21 36.01,24.7 34.86,24.7 34.5,25.06 R1.1 33.05,25.06 32.43,25.67 31.34,25.67 v30.66,26.35
  Bottom 0.152: U2.47 29,31.17 31.34,28.83 31.34,27.69 31.17,27.51 31.17,27.43 30.66,26.93 v30.66,26.35
!LORA_RST  (via drill 0.35)
  Top 0.152: R21.1 40.39,45.55 | 40.39,45.55 40.47,45.55 42.21,47.29 U4.6 | 40.39,45.55 38.86,44.03 v38.86,43.43
  Bottom 0.152: v38.86,43.43 38.86,39.12 37.54,37.8 U2.69
!LORA_SS  (via drill 0.35)
  Top 0.152: U4.5 44.21,39.89 v42.42,38.1
  Bottom 0.152: U2.79 40.97,31.17 40.39,31.75 40.39,32.96 41.08,33.66 41.08,36.77 v42.42,38.1
!RESET  (via drill 0.35)
  Top 0.152: v22.93,21.84 22.15,23.14 17.88,23.14 15.87,25.14 15.87,30.91 16.24,31.28 16.26,31.28 16.35,31.37 17.27,31.37 17.5,31.14 20.06,31.14 20.42,31.5 20.42,32.43 v20.33,32.52 | RESET.2 RESET.1 16.68,46.79 R13.1 16.68,40.94 16.98,40.64 v16.98,39.62
  Bottom 0.152: 24.89,22.67 23.98,22.67 R3.1 23.46,22.35 v22.93,21.84 | 24.89,22.67 U2.30 | ISP.5 35.05,6.58 28.59,13.05 28.59,15.75 28.59,16 28.14,16.45 26.73,16.45 25.91,17.27 25.91,18.68 24.89,19.7 24.89,22.67 | v16.98,39.62 18.2,38.41 18.67,38.41 19.61,37.47 19.61,33.24 v20.33,32.52
+3V3  (via drill 0.35)
  Top 0.152: IC1.8 49.98,24.68 | 49.98,24.68 49.51,25.16 48.97,25.16 48.59,24.78 IC1.10 | C1.1 37.69,25.92 37.99,25.62 37.99,22.86 U1.P$1 | v50.19,25.4 49.98,25.19 49.98,24.68 | C4.1 C3.1 4.83,25.82 | IC1.1 47.28,20.61 v46.48,19.81 | R13.2 19.56,43.94 v20.07,43.43
  Top 0.254: 5.24,27.27 v3.8,28.71 4.33,28.71 v5.84,30.22 | 5.24,27.27 4.66,26.7 C3.1 5.76,25.65 6.59,24.82 6.59,24.62 U3.4 | 5.24,27.27 U3.1 | v13.72,31.73 19.79,31.73 v19.81,31.75 | LED_RX.A 47.75,31.48 | 47.75,31.48 LED_TX.A | 47.83,27.76 47.72,27.87 46.16,27.87 | 47.83,27.76 v50.19,25.4 | 46.16,27.87 44.96,26.67 C17.1 43.78,24.55 | 42.16,14.22 42.16,17.44 C15.1 C16.1 43.78,24.55 | 42.16,14.22 42.16,4.06 40.89,2.79 ISP.2 | 47.83,27.76 47.83,31.41 47.75,31.48 | 46.16,27.87 46.03,28 46.03,29.41 v44.7,30.73 | v46.23,33.33 46.23,35.41 U4.13 | v43.69,14.22 42.16,14.22 | 37.99,22.86 37.99,21.99 v36.58,20.57 36.3,20.3 31.36,20.3 30.48,21.17 30.48,21.28 29.57,21.28 29.5,21.21 v28.7,21.21 | v44.66,23.92 43.78,24.55 | U1.P$1 37.99,25.34 C1.1 37.68,26.92 | 37.68,26.92 C2.1 38.61,27.27 v38.61,27.18 | R1.2 37.51,26.76 37.68,26.92 | v34.29,42.16 34.54,42.42 R21.2 | LED_GPS.A 26.42,24.89 25.91,24.38 v25.33,24.38
  Bottom 0.152: v46.48,19.81 46.48,21.69 v50.19,25.4 | v20.07,43.43 22.99,40.51 22.99,37.47
  Bottom 0.254: U6.1 3.13,28.04 v3.8,28.71 | R14.2 21.84,31.58 | 21.84,31.58 R20.2 21.59,36.07 22.99,37.47 23.03,37.51 U5.1 24.46,37.51 26.28,35.69 33.66,35.69 | v5.84,30.22 7,30.22 8.11,31.34 12.04,31.34 12.17,31.47 12.7,31.47 12.95,31.73 v13.72,31.73 | v19.81,31.75 21.68,31.75 21.84,31.58 | U2.80 44.64,30.67 v44.7,30.73 46.23,32.26 v46.23,33.33 | C12.1 C10.1 C9.1 C8.1 43.94,15.07 | 43.94,15.07 C11.1 | 43.94,15.07 43.94,14.48 v43.69,14.22 | U2.10 36.04,20.04 v36.58,20.57 37.67,21.67 U2.98 42.42,21.59 43.35,21.59 43.51,21.43 43.51,21.08 | 43.51,21.08 43.51,20.91 43.35,20.75 42.42,20.75 U2.100 | 43.51,21.08 44.66,22.23 v44.66,23.92 | 33.66,35.69 33.54,35.58 U2.61 33.54,32.84 36.47,29.62 36.98,29.62 38.61,28 v38.61,27.18 | 33.66,35.69 34.16,36.2 34.16,42.04 v34.29,42.16 | v25.33,24.38 23.96,24.38 R3.2 25.18,23.17 U2.31 26.83,23.09 27.75,23.09 28.19,22.65 28.19,21.59 28.57,21.21 v28.7,21.21
+5V  (via drill 0.35)
  Top 0.152: I2C_1.1 15.24,33.02
  Top 0.254: v17.02,37.49 16.32,38.19 16.32,40.78 13.43,43.67 9.65,43.67
  Top 1.016: PPM0.2 PPM1.2 PPM2.2 14.99,15.24 | 14.99,15.24 PPM3.2 | SONAR0.1 SONAR1.1 | I2C_1.1 11.68,33.02 | 11.68,33.02 I2C_0.1 UART2.1 5.69,34.14 5.92,34.14 7.21,35.43 7.21,41.23 9.65,43.67 POWER.2 | SONAR0.1 14.99,20.57 14.99,15.24 | SONAR0.1 12.85,22.71 12.62,22.71 11.68,23.64 11.68,33.02
  Bottom 0.152: R22.2 15.66,33.02 I2C_1.1
  Bottom 0.254: PPM0.2 3.56,15.24 4.73,16.41 4.73,19.15 4.72,19.16 4.72,19.41 3.13,21 U6.14 | U5.14 18.15,37.49 v17.02,37.49
  Bottom 1.016: SONAR0.1 11.01,21.59 10.61,21.99 10.61,22.28 10.22,22.66 9.94,22.66 R23.2
BARO_INT1  (via drill 0.35)
  Top 0.152: v7.39,31.55 7.39,31.12 8.54,29.98 8.54,29.05 9.26,28.33 9.26,25.6 U3.6 | v16.8,34.26 17.3,34.77 17.27,34.8 17.27,35.59 18.53,36.84 18.55,36.84 19.25,37.54 27.67,37.54 30.47,34.74 v30.47,32.5
  Bottom 0.152: 7.41,31.55 v7.39,31.55 7.82,31.55 7.96,31.7 11.43,31.7 12.47,32.74 12.47,33.43 13.05,34.01 16.55,34.01 v16.8,34.26 | U2.89 40.99,26.17 40.34,25.53 35.06,25.53 32.56,28.03 32.56,29.34 30.47,31.43 v30.47,32.5
BARO_INT2  (via drill 0.35)
  Top 0.152: v6.35,31.98 6.35,31.73 8.23,29.85 8.23,28.93 8.96,28.2 8.96,24.66 U3.5 | v31.24,33.02 31.24,34.4 27.8,37.85 19.1,37.85 v16.21,34.95
  Bottom 0.152: v6.35,31.98 6.96,31.98 7.14,32.16 7.93,32.16 8.09,32 11.18,32 12.17,32.99 12.17,33.56 12.93,34.31 15.57,34.31 v16.21,34.95 | U2.88 41.06,26.67 40.22,25.83 35.32,25.83 32.87,28.28 32.87,29.46 31.24,31.09 v31.24,33.02
GND  (via drill 0.35)
  other vias: 24.13,32.77 9.14,29.46 35.31,21.08 45.97,24.89 49.28,19.81 26.92,36.58 27.94,20.07 32.51,26.42 40.39,20.83 34.92,27.43 7.75,28.19
  pour Top: -6.35,105.41 -6.35,-1.27 30.23,-9.91 191.01,-31.5 193.04,95.25 176.53,111.76 5.08,111.76 -1.27,105.41
  pour Bottom: -13.97,102.87 -13.97,12.7 -11.68,-13.21 88.9,-79.76 173.99,8.89 173.99,93.98 160.02,107.95 -5.08,107.95 -7.62,105.41 -11.43,105.41
GPS_1PPS  (via drill 0.35)
  Top 0.152: U1.P$13 27.49,13.81 29.97,16.29 v29.97,20.32
  Bottom 0.152: v29.97,20.32 30.99,21.34 30.99,25.82 31.27,26.1 31.27,27.1 31.65,27.48 31.65,28.96 28.94,31.67 U2.48
GPS_RX  (via drill 0.35)
  Top 0.152: v29.75,26.45 28.69,26.45 27.76,25.52 25.01,25.52 24.49,25 U1.P$10
  Bottom 0.152: U2.46 28.63,30.67 28.64,30.67 29.08,30.67 31.04,28.7 31.04,27.81 30.74,27.51 30.74,27.43 v29.75,26.45
GPS_TX  (via drill 0.35)
  Top 0.152: 26.15,22.89 26.14,22.89 U1.P$9 25.99,23.96 26.16,24.13 27.55,24.13 27.82,24.4 27.82,25.14 28.2,25.52 28.79,25.52 v29.09,25.82
  Bottom 0.152: U2.45 28.45,30.17 28.45,30.16 29.15,30.16 30.73,28.58 30.73,27.94 29.85,27.05 29.5,27.05 29.09,26.65 v29.09,25.82
LED0  (via drill 0.35)
  Top 0.152: R15.2 v20.32,9.91
  Bottom 0.152: v20.32,9.91 19.51,10.72 16.46,10.72 15.85,11.33 15.85,18.21 16.69,19.05 20.83,19.05 22.33,20.55 22.33,24.38 23.14,25.2 25.09,25.2 25.15,25.15 26.72,25.15 U2.35
LED1  (via drill 0.35)
  Top 0.152: R10.2 v17.78,9.91
  Bottom 0.152: v17.78,9.91 17.27,10.41 16.26,10.41 15.54,11.12 15.54,18.34 16.56,19.36 20.7,19.36 22.02,20.68 22.02,24.51 23.02,25.5 25.49,25.5 25.65,25.67 U2.36
LED2  (via drill 0.35)
  Top 0.152: R11.2 v15.24,9.91
  Bottom 0.152: v15.24,9.91 15.24,18.54 16.36,19.66 20.58,19.66 21.72,20.8 21.72,24.64 22.89,25.81 25.04,25.81 25.4,26.17 U2.37
LED3  (via drill 0.35)
  Top 0.152: R12.2 13.78,7.39 v13.78,6.76 | v28.7,10.06 29.71,10.06 30.07,10.42 30.07,10.84 31.07,11.84 33.29,11.84 39.67,18.23 39.67,26.15 v40.48,26.96
  Bottom 0.152: v13.78,6.76 14.08,7.06 18.76,7.06 22.07,10.36 27.94,10.36 28.24,10.06 v28.7,10.06 | U2.87 40.7,27.17 v40.48,26.96
LED4  (via drill 0.35)
  Top 0.152: v29.46,10.67 30.94,12.15 33.17,12.15 39.37,18.35 39.37,27.13 v39.88,27.64 | R16.2 10.16,9.4 v10.54,9.78
  Bottom 0.152: v29.46,10.67 21.94,10.67 18.64,7.37 13.97,7.37 11.56,9.78 v10.54,9.78 | U2.86 42.33,27.69 41.91,27.69 41.86,27.64 v39.88,27.64
LED5  (via drill 0.35)
  Top 0.152: R17.2 v7.62,10.16
  Bottom 0.152: v7.62,10.16 7.11,10.67 5.95,10.67 5.69,10.92 5.69,18.04 7.62,19.96 20.45,19.96 21.41,20.93 21.41,26.39 22.02,27 23.99,27 24.66,27.67 U2.40
LED6  (via drill 0.35)
  Top 0.152: v5.08,10.16 R18.2
  Bottom 0.152: U2.41 24.73,28.17 23.86,27.3 21.89,27.3 21.11,26.52 21.11,21.05 20.32,20.27 7.49,20.27 5.39,18.16 5.39,10.98 5.08,10.67 v5.08,10.16
LED7  (via drill 0.35)
  Top 0.152: R19.2 v2.54,10.16
  Bottom 0.152: v2.54,10.16 2.54,10.54 3.18,11.18 4.78,11.18 5.08,11.48 5.08,11.68 | U2.42 24.8,28.67 23.74,27.61 21.77,27.61 20.8,26.64 20.8,21.18 20.2,20.57 7.37,20.57 5.08,18.29 5.08,11.68 | 5.08,11.68
LORA_DIO0  (via drill 0.35)
  Top 0.152: U4.14 48.21,33.23 47.71,32.72 44.45,32.72 43.33,31.6 37.91,31.6 36.95,32.55 36.09,32.55 35.81,32.84 v34.88,32.84
  Bottom 0.152: U2.63 34.54,33.17 v34.88,32.84
LORA_DIO1  (via drill 0.35)
  Top 0.152: U4.15 50.21,33.96 48.67,32.42 44.58,32.42 43.45,31.29 37.78,31.29 36.83,32.24 36.08,32.24 36.07,32.23 v35.55,32.23
  Bottom 0.152: 35.04,33.79 U2.64 35.04,33.53 35.48,33.09 35.48,32.3 v35.55,32.23
LORA_DIO2  (via drill 0.35)
  Top 0.152: U4.16 52.21,33.42 50.91,32.11 44.7,32.11 43.58,30.99 37.23,30.99 v36.58,31.64
  Bottom 0.152: U2.65 35.54,33.46 36.16,32.84 36.16,32.05 v36.58,31.64
LORA_DIO3  (via drill 0.35)
  Top 0.152: U4.11 42.21,33.58 41.66,33.02 39.17,33.02 v38.35,32.2
  Bottom 0.152: U2.66 36.18,34.34 36.18,33.48 37.45,32.2 v38.35,32.2
LORA_DIO4  (via drill 0.35)
  Top 0.152: U4.12 44.45,35.19 44.45,33.15 43.2,31.9 39.67,31.9 v39.37,32.2
  Bottom 0.152: U2.67 36.61,34.4 36.61,33.55 37.35,32.81 38.76,32.81 v39.37,32.2
LORA_DIO5  (via drill 0.35)
  Top 0.152: U4.7 40.21,48.77 39.37,47.93 v39.37,46.74
  Bottom 0.152: 36.91,34.04 36.91,34.34 U2.68 37.08,34.51 37.08,36.07 37.24,36.22 37.24,37.92 38.56,39.24 38.56,42.88 38.26,43.18 38.26,43.69 39.37,44.8 v39.37,46.74
MISO  (via drill 0.35)
  Top 0.152: v50.8,47.5 50.04,48.26 50.04,51.05 50.21,50.88 U4.2
  Bottom 0.152: U2.22 30.04,17.22 28.89,16.07 28.89,13.17 36.11,5.96 36.11,2.88 37.18,1.8 38,1.8 39.12,2.92 39.12,4.32 ISP.1 40.13,13.94 42.45,16.26 49.78,16.26 52.45,18.92 52.45,45.85 v50.8,47.5
MOSI  (via drill 0.35)
  Top 0.152: v49.02,47.75 48.21,48.56 U4.3
  Bottom 0.152: U2.21 30.54,17.29 29.2,15.94 29.2,13.3 36.58,5.92 36.58,3.81 ISP.4 37.59,3.93 38.58,4.92 38.58,5.56 39.83,6.81 39.83,14.06 42.33,16.56 49.66,16.56 52.14,19.05 52.14,45.73 50.98,46.89 49.88,46.89 v49.02,47.75
N$1
  Top 0.152: U1.P$11 24.49,6.5 24.64,6.35 26.42,6.35 26.67,6.1 GPS_ANT.P
N$2  (via drill 0.35)
  Top 0.152: C6.2 28.96,30.3 Y1.P$2 28.88,28.88 v28.45,28.45
  Bottom 0.152: U2.34 27.94,24.67 28.18,24.91 28.18,28.18 v28.45,28.45
N$3  (via drill 0.35)
  Top 0.152: C7.2 32.51,32.26 32.51,30.3 Y1.P$1 32.55,30.19 31.23,30.19 29.84,28.8 29.71,28.8 v29.36,28.45
  Bottom 0.152: U2.33 27.87,24.17 28.48,24.78 28.48,27.57 v29.36,28.45
N$4
  Top 0.152: R6.1 C13.2 51.77,16.62 51.77,21.25 50.48,22.54 IC1.6
N$5
  Top 0.152: R7.2 C14.2 49.1,14.81 49.1,13.87 50.16,12.82 51.45,12.82 52.07,13.45 52.07,21.59 50.48,23.18 IC1.7
N$6  (via drill 0.35)
  Top 0.152: IC1.5 50.4,21.47 v50.68,21.22 | v51.23,23.29 51.23,24.97 50.8,25.4 R4.1
  Bottom 0.152: v50.68,21.22 51.23,22.02 v51.23,23.29
N$7
  Top 0.152: R5.1 47.94,26.14 IC1.11
N$8
  Top 0.152: R4.2 LED_TX.C
N$9
  Top 0.152: R5.2 LED_RX.C
N$10
  Top 0.152: R6.2 50.8,11.68 49.64,10.53 48.72,10.53 48.26,10.07 J3.D+
N$11
  Top 0.152: J3.D- 47.46,11.05 R7.1
N$12
  Top 0.152: R2.1 31.99,24.74 U1.P$5
N$13
  Top 0.152: R2.2 LED_GPS.C
N$15
  Top 0.152: R10.1 LED1.A
N$16
  Top 0.152: R8.2 45.72,11.43 46.66,10.49 J3.VBUS
N$17  (via drill 0.35)
  Top 0.152: U3.2 7.62,26.02 7.37,26.28 v6.35,26.28 | C5.1 4.66,21.74 5.44,22.52 5.44,24.23 v5.84,24.64
  Bottom 0.152: v5.84,24.64 5.84,25.51 v6.35,26.28
N$18
  Top 0.152: R11.1 LED2.A
N$20
  Top 0.152: LED3.A R12.1
N$22
  Top 0.152: R16.1 LED4.A
N$24
  Top 0.152: R17.1 LED5.A
N$27
  Top 0.152: R18.1 LED6.A
N$29
  Top 0.152: LED7.A R19.1
N$30
  Top 0.254: U4.9 38.21,37.59 37.2,38.61 33.78,38.61 29.46,42.93 LORA.P
N$31
  Top 0.152: LED0.A R15.1
N$36
  Bottom 0.152: R23.1 7.07,21.5 U6.8
N$37
  Bottom 0.152: R22.1 18.16,32.22 U5.8
PPM0  (via drill 0.35)
  Top 0.152: v14.22,10.11 14.64,10.53 14.99,10.53 15.51,11.05 19.44,11.05 19.56,10.93 20.49,10.93 v20.66,11.1 | v6.3,16.51 3.81,16.51 PPM0.1 | v26.52,18.39 26.3,18.6 v25.13,18.6
  Bottom 0.152: v14.22,10.11 13.72,10.11 13.41,10.41 10.41,10.41 9.65,11.18 9.65,15.37 8.51,16.51 v6.3,16.51 | v20.66,11.1 20.66,11.98 20.75,12.07 20.75,12.82 20.44,13.13 20.44,17.14 22.26,18.96 23.61,18.96 23.98,18.6 v25.13,18.6 | U2.24 29.04,17.36 28.7,17.02 27.94,17.02 27.68,16.76 27.4,16.76 27.39,16.76 26.85,16.76 26.21,17.4 26.21,18.09 v26.52,18.39
PPM1  (via drill 0.35)
  Top 0.152: v19.81,11.54 19.63,11.35 14.8,11.35 v14.58,11.13 | v26.42,19.3 26,19.3 25.91,19.2 24.23,19.2 v24.13,19.3
  Bottom 0.152: v14.58,11.13 14.17,10.72 10.62,10.72 9.96,11.38 9.96,15.5 7.67,17.78 PPM1.1 | v19.81,11.54 19.81,11.56 20.44,12.2 20.44,12.7 20.14,13 20.14,17.34 22.26,19.47 23.96,19.47 v24.13,19.3 | U2.25 28.54,17.88 28.45,17.78 27.94,17.78 27.5,18.23 27.55,18.27 27.55,18.78 27.19,19.13 27.18,19.13 27.02,19.3 v26.42,19.3
PPM2  (via drill 0.35)
  Top 0.152: v19.84,12.45 19.05,11.66 15.62,11.66 15.24,12.04 v14.63,12.04 | v23.62,20.08 24.64,20.08 24.9,19.81 v25.65,19.81
  Bottom 0.152: PPM2.1 10.26,15.34 10.26,11.51 10.74,11.02 13.61,11.02 v14.63,12.04 | v19.84,12.45 19.84,17.55 22.36,20.08 v23.62,20.08 | v25.65,19.81 25.89,19.81 U2.26
PPM3  (via drill 0.35)
  Top 0.152: PPM3.1 27.05,17.78 28.91,19.64 28.91,20.11 29.72,20.93 30.22,20.93 31.21,19.94 37.57,19.94 v37.95,20.32
  Bottom 0.152: U2.5 38.54,19.72 v37.95,20.32
SCK  (via drill 0.35)
  Top 0.152: v46.48,47.5 46.21,47.77 U4.4
  Bottom 0.152: U2.20 31.04,17.36 29.5,15.81 29.5,13.43 ISP.3 39.52,7.26 39.52,14.19 42.2,16.87 49.53,16.87 51.84,19.17 51.84,23.54 51.82,23.56 51.82,45.62 50.85,46.59 47.39,46.59 v46.48,47.5
SCL  (via drill 0.35)
  Top 0.152: v22.98,32.51 22.98,29.52 v22.67,29.21 | U3.8 10.11,27.3 v10.11,28.15
  Bottom 0.152: 26.7,29.12 U2.43 24.87,29.17 24.26,28.57 | 21.57,27.91 21.31,27.66 11.79,27.66 11.3,28.15 v10.11,28.15 | 21.57,27.91 23.61,27.91 24.26,28.57 | R14.1 23.88,28.96 24.26,28.57 | v22.98,32.51 22.67,32.81 22.67,34.54 23.04,34.91 U5.5 | 21.57,27.91 21.89,28.25 21.89,28.43 v22.67,29.21
SCL_5V
  Top 0.152: I2C_1.3 I2C_0.3
  Bottom 0.152: I2C_1.3 18.55,38.1 19.3,37.34 19.3,35.16 19.05,34.91 U5.10
SDA  (via drill 0.35)
  Top 0.152: U3.7 10.92,26.85 10.92,28.2 10.54,28.57 v10.54,29.05
  Bottom 0.152: 21.8,29.67 R20.1 | 24.52,30.61 25.46,29.67 U2.44 | 24.52,30.61 23.23,30.61 22.5,29.88 R20.1 | R20.1 21.59,28.37 21.18,27.96 11.91,27.96 10.82,29.05 v10.54,29.05 | U5.4 24.64,35.56 25.1,35.1 25.1,31.19 24.52,30.61
SDA_5V
  Top 0.152: I2C_0.2 I2C_1.2
  Bottom 0.152: U5.11 I2C_1.2
SONAR0_ECHO_3V3  (via drill 0.35)
  Top 0.152: v40.59,28.24 39.01,28.24 38.33,28.92 35.34,28.92 33.9,27.49 26.41,27.49 25.65,28.24 22.18,28.24 20.22,30.2 17.88,30.2 17.58,29.9 v17.11,29.9
  Bottom 0.152: U6.2 3.78,27.83 5.26,29.31 7.02,29.31 8.39,30.68 8.64,30.68 12.32,30.68 12.45,30.81 15.49,30.81 16.4,29.9 v17.11,29.9 | v40.59,28.24 42.27,28.24 U2.85
SONAR0_ECHO_5V
  Bottom 0.152: U6.13 3.78,22.79 4.22,23.23 5.35,23.23 7.85,25.73 13.03,25.73 SONAR0.3
SONAR0_TRIGGER_3V3  (via drill 0.35)
  Top 0.152: v22.02,25.8 21.34,25.12 18,25.12 16.99,26.14 16.99,27.41 16.99,27.43 16.48,27.94 v16.48,29.24
  Bottom 0.152: v22.02,25.8 22.34,26.11 24.84,26.11 25.4,26.67 U2.38 | v16.48,29.24 16.48,29.39 15.37,30.5 12.57,30.5 12.44,30.38 8.51,30.38 8.5,30.36 7.14,29.01 5.38,29.01 4.43,28.05 U6.3
SONAR0_TRIGGER_5V  (via drill 0.35)
  Top 0.152: v6.65,22.81 6.65,21.13 v5.84,20.32
  Bottom 0.152: 4.43,21.59 U6.12 4.43,20.72 4.83,20.32 v5.84,20.32 | v6.65,22.81 6.65,23.24 8.23,24.82 13.28,24.82 SONAR0.2
SONAR1_ECHO_3V3  (via drill 0.35)
  Top 0.152: v39.88,28.85 38.83,28.85 38.45,29.23 35.21,29.23 33.77,27.79 26.54,27.79 25.78,28.55 22.31,28.55 20.35,30.5 16.66,30.5 v16.49,30.67
  Bottom 0.152: U6.4 4.81,27.03 4.81,26.71 4.68,26.58 2.88,26.58 2.75,26.71 2.75,28.91 3.45,29.62 6.89,29.62 8.26,30.98 12.19,30.98 12.32,31.11 16.05,31.11 v16.49,30.67 | v39.88,28.85 41.15,28.85 41.33,28.67 U2.84
SONAR1_ECHO_5V
  Bottom 0.152: U6.11 5.08,22.53 7.98,25.43 17.8,25.43 17.91,25.53 SONAR1.3
SONAR1_TRIGGER_3V3  (via drill 0.35)
  Top 0.152: v24.84,26.97 24.28,26.42 21.78,26.42 20.79,25.43 18.13,25.43 17.3,26.26 17.3,28.42 17.15,28.57 v17.1,28.57
  Bottom 0.152: U2.39 25.04,27.17 v24.84,26.97 | v17.1,28.57 16.26,28.57 15.87,28.95 15.87,29.57 15.24,30.2 12.7,30.2 12.57,30.07 8.64,30.07 7.27,28.7 6.24,28.7 5.73,28.19 U6.5
SONAR1_TRIGGER_5V
  Bottom 0.152: SONAR1.2 18.16,25.02 18.06,25.12 8.1,25.12 5.73,22.75 U6.10
UART2_RX
  Bottom 0.152: U5.2 24.03,36.83 24.64,36.83 32.26,29.21 32.26,27.23 31.88,26.85 31.88,25.85 31.6,25.57 31.6,21.66 32.38,20.88 34.16,20.88 35.04,20 U2.12
UART2_RX_5V
  Bottom 0.152: U5.13 5.81,36.86 UART2.3
UART2_TX
  Bottom 0.152: U2.13 34.54,20.07 34.04,20.57 32.26,20.57 31.29,21.54 31.29,25.7 31.57,25.97 31.57,26.98 31.95,27.36 31.95,29.08 24.83,36.21 U5.3
UART2_TX_5V
  Bottom 0.152: U5.12 17.27,36.21 16.93,36.55 5.56,36.55 UART2.2
USB_RX  (via drill 0.35)
  Top 0.152: v45.55,22.1 45.98,22.54 IC1.15
  Bottom 0.152: U2.2 40.05,19.73 40.31,19.99 43.44,19.99 v45.55,22.1
USB_TX  (via drill 0.35)
  Top 0.152: v47.75,19.81 47.94,20 IC1.2
  Bottom 0.152: U2.3 39.54,17.61 39.88,17.27 40.64,17.27 41.15,17.78 41.15,19.05 41.78,19.68 45.75,19.68 46.23,19.2 47.15,19.2 v47.75,19.81
VBUS_SENSE
  Top 0.152: R8.1 R9.2 46.99,16.93 46.99,18.27 44.94,20.32 44.94,23.09 45.27,23.41 45.27,24.17 45.21,24.23 45.21,25.15 45.97,25.91 46.99,25.91 47.24,25.65 47.24,24.63 IC1.12